# Altium project RK3588底板.PrjPcb (part 1 of 2)
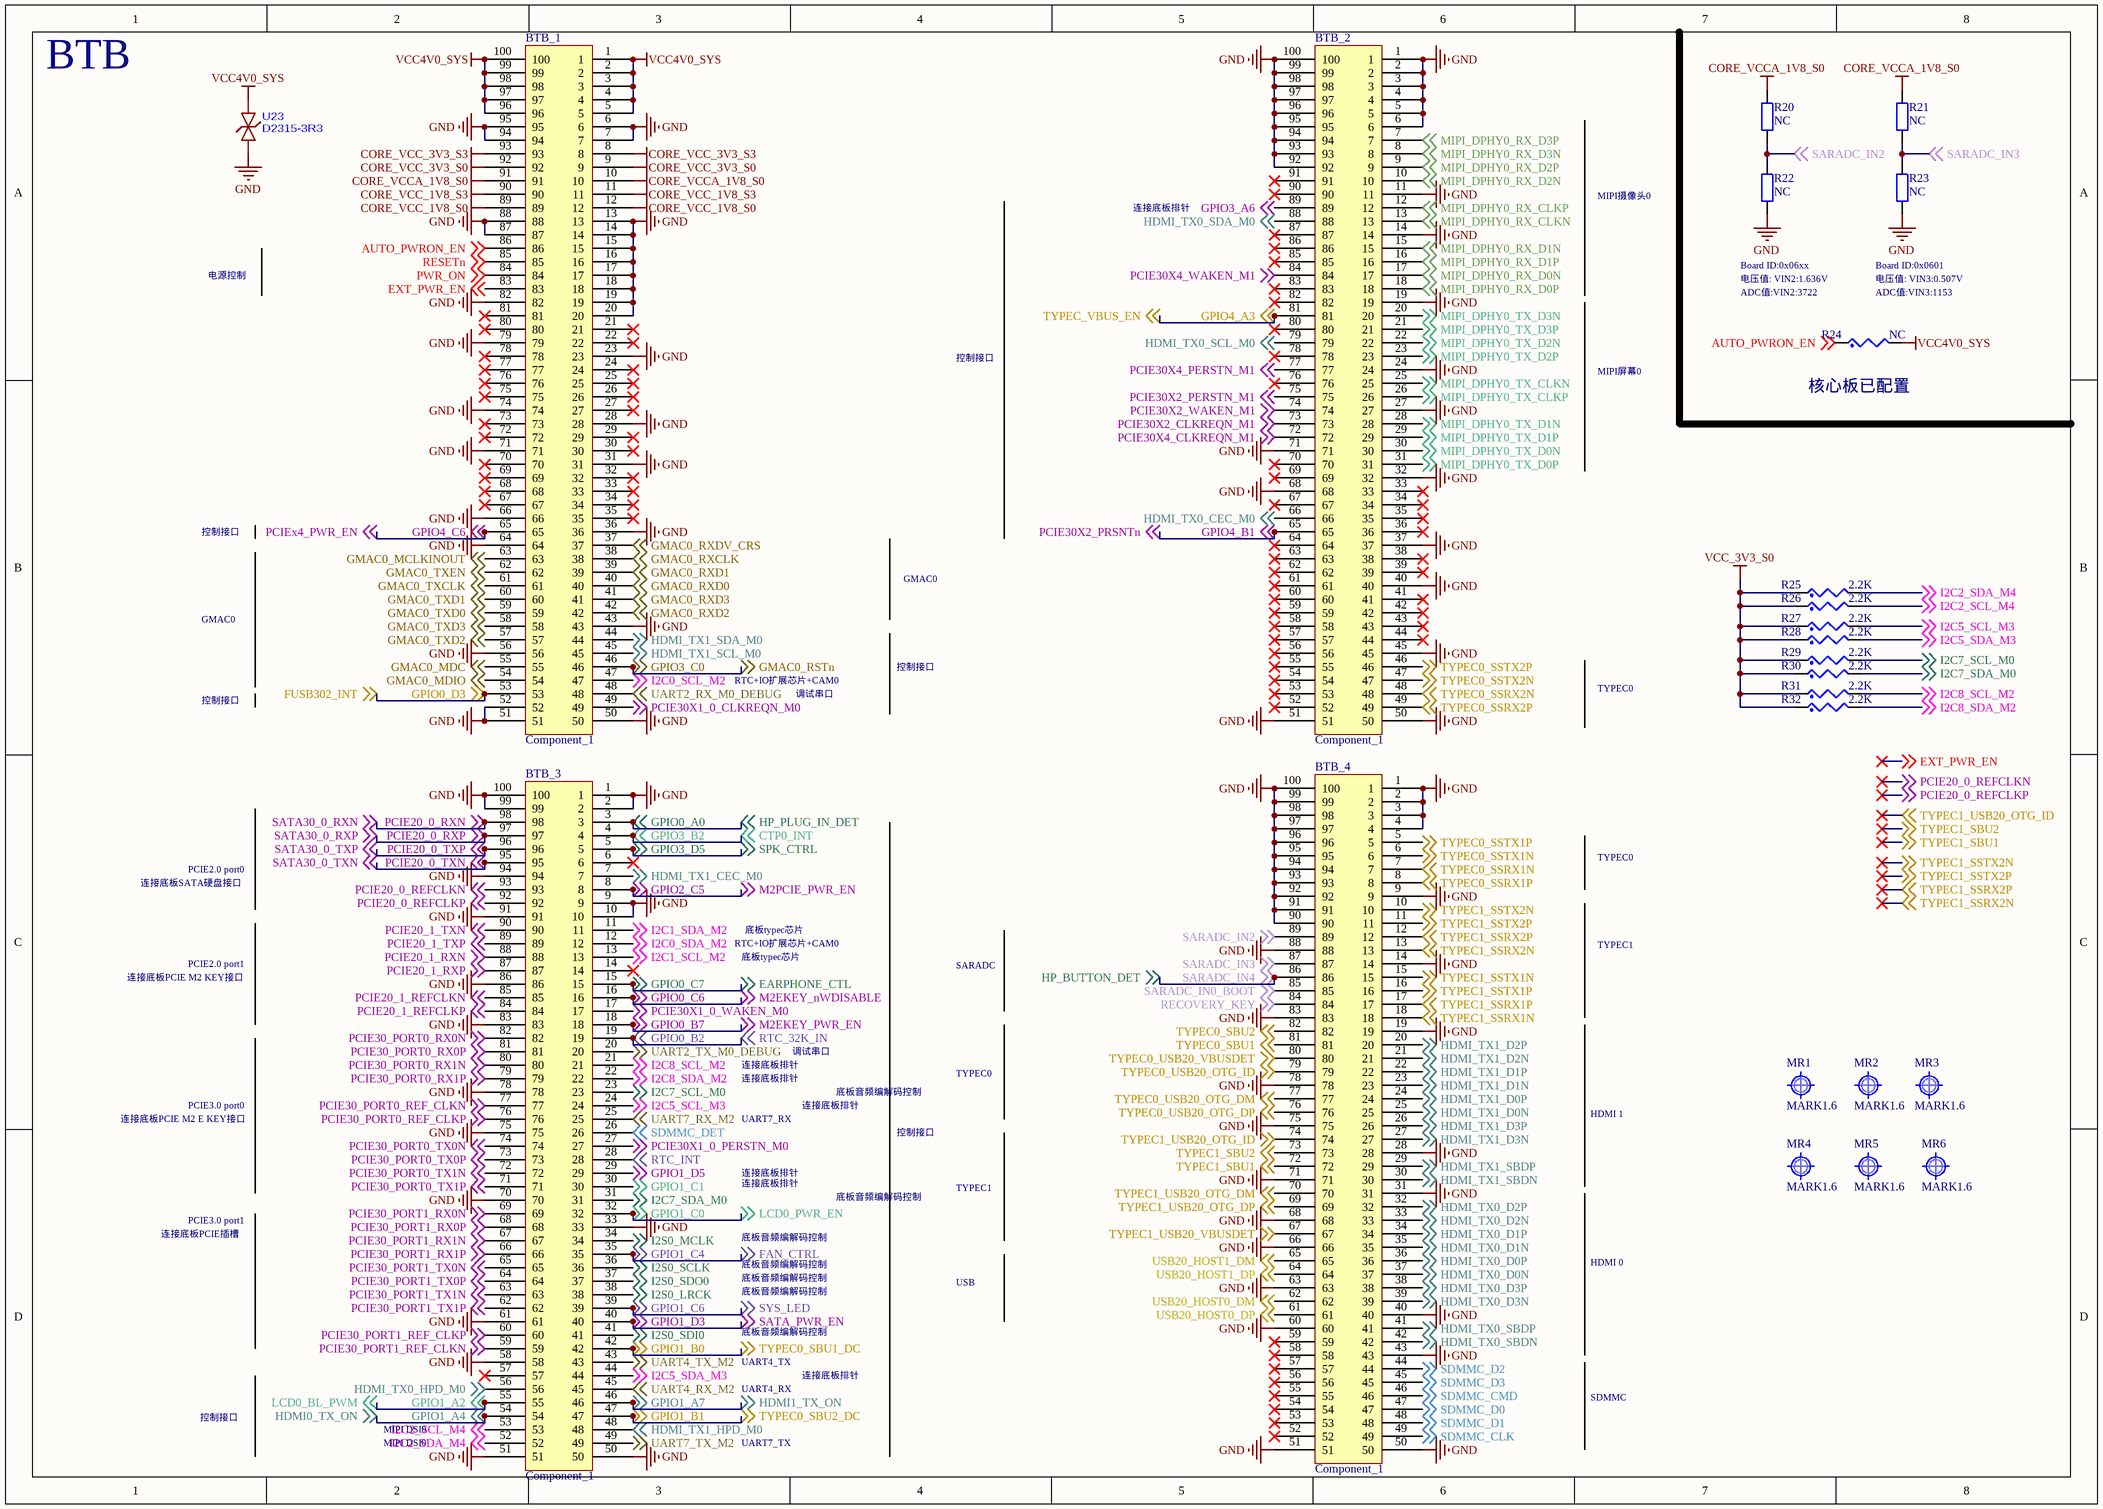
[diagram p0: 1.BTB.SchDoc]
13 sheets, 715 parts. Net scope: global (net labels, ports and power ports of the same name join across sheets).
Board file: 0.PCB1.PcbDoc
Sheets:
  1.BTB.SchDoc
  2.电源.SchDoc
  3.DEBUG_SD卡_RTC_按键.SchDoc
  4.以太网_eth1.SchDoc
  5.USB3.SchDoc
  6.音频_FAN_ADC_LED.SchDoc
  7.HDMI2.SchDoc
  8.HDMI2.SchDoc
  9.PCIE3.SchDoc
  10.PCIE2.SchDoc
  11.MIPI DSI_CSI.SchDoc
  12.SATA接口.SchDoc
  13.GPIO扩展接口.SchDoc

## Sheet 1.BTB.SchDoc
size A3; SheetNumber: 1; SheetTotal: 13

### Parts
BTB_1  Component_1  [F_100PIN]
BTB_2  Component_1  [F_100PIN]
BTB_3  Component_1  [F_100PIN]
BTB_4  Component_1  [F_100PIN]
MR1  MARK1.6  [Mark 1]
MR2  MARK1.6  [Mark 1]
MR3  MARK1.6  [Mark 1]
MR4  MARK1.6  [Mark 1]
MR5  MARK1.6  [Mark 1]
MR6  MARK1.6  [Mark 1]
R20  NC  [R0402_L]
R21  NC  [R0402_L]
R22  NC  [R0402_L]
R23  NC  [R0402_L]
R24  NC  [R0402]
R25  2.2K  [R0402]
R26  2.2K  [R0402]
R27  2.2K  [R0402]
R28  2.2K  [R0402]
R29  2.2K  [R0402]
R30  2.2K  [R0402]
R31  2.2K  [R0402]
R32  2.2K  [R0402]
U23  D2315-3R3  [DFN1006-2L-BI]

### Nets
CORE_VCC_1V8_S0: BTB_1.12 BTB_1.89
CORE_VCC_1V8_S3: BTB_1.11 BTB_1.90
CORE_VCC_3V3_S0: BTB_1.9 BTB_1.92
CORE_VCC_3V3_S3: BTB_1.8 BTB_1.93
CORE_VCCA_1V8_S0: BTB_1.10 BTB_1.91 R20.2 R21.2
GND: BTB_1.6 BTB_1.7 BTB_1.13 BTB_1.14 BTB_1.15 BTB_1.16 BTB_1.17 BTB_1.18 BTB_1.19 BTB_1.20 BTB_1.23 BTB_1.28 BTB_1.31 BTB_1.36 BTB_1.43 BTB_1.50 BTB_1.51 BTB_1.52 BTB_1.56 BTB_1.64 BTB_1.66 BTB_1.71 BTB_1.74 BTB_1.79 BTB_1.82 BTB_1.87 BTB_1.88 BTB_1.94 BTB_1.95 BTB_2.1 BTB_2.2 BTB_2.3 BTB_2.4 BTB_2.5 BTB_2.6 BTB_2.11 BTB_2.14 BTB_2.19 BTB_2.24 BTB_2.27 BTB_2.32 BTB_2.37 BTB_2.40 BTB_2.45 BTB_2.50 BTB_2.51 BTB_2.68 BTB_2.71 BTB_2.92 BTB_2.93 BTB_2.94 BTB_2.95 BTB_2.96 BTB_2.97 BTB_2.98 BTB_2.99 BTB_2.100 BTB_3.1 BTB_3.2 BTB_3.9 BTB_3.10 BTB_3.33 BTB_3.50 BTB_3.51 BTB_3.58 BTB_3.61 BTB_3.70 BTB_3.75 BTB_3.78 BTB_3.83 BTB_3.86 BTB_3.91 BTB_3.94 BTB_3.99 BTB_3.100 BTB_4.1 BTB_4.2 BTB_4.3 BTB_4.4 BTB_4.9 BTB_4.14 BTB_4.19 BTB_4.28 BTB_4.31 BTB_4.40 BTB_4.43 BTB_4.50 BTB_4.51 BTB_4.60 BTB_4.63 BTB_4.66 BTB_4.68 BTB_4.71 BTB_4.75 BTB_4.78 BTB_4.83 BTB_4.88 BTB_4.90 BTB_4.91 BTB_4.92 BTB_4.93 BTB_4.94 BTB_4.95 BTB_4.96 BTB_4.97 BTB_4.98 BTB_4.99 BTB_4.100 R22.1 R23.1 U23.1
VCC4V0_SYS: BTB_1.1 BTB_1.2 BTB_1.3 BTB_1.4 BTB_1.5 BTB_1.96 BTB_1.97 BTB_1.98 BTB_1.99 BTB_1.100 R24.2 U23.2
VCC_3V3_S0: R25.1 R26.1 R27.1 R28.1 R29.1 R30.1 R31.1 R32.1
AUTO_PWRON_EN: BTB_1.86 R24.1 ; off-sheet AUTO_PWRON_EN
CTP0_INT: BTB_3.4 ; off-sheet GPIO3_B2, off-sheet CTP0_INT  [also labelled GPIO3_B2]
EARPHONE_CTL: BTB_3.15 ; off-sheet GPIO0_C7, off-sheet EARPHONE_CTL  [also labelled GPIO0_C7]
EXT_PWR_EN: BTB_1.83 ; off-sheet EXT_PWR_EN
FAN_CTRL: BTB_3.35 ; off-sheet GPIO1_C4, off-sheet FAN_CTRL  [also labelled GPIO1_C4]
FUSB302_INT: BTB_1.53 ; off-sheet GPIO0_D3, off-sheet FUSB302_INT  [also labelled GPIO0_D3]
GMAC0_MCLKINOUT: BTB_1.63 ; off-sheet GMAC0_MCLKINOUT
GMAC0_MDC: BTB_1.55 ; off-sheet GMAC0_MDC
GMAC0_MDIO: BTB_1.54 ; off-sheet GMAC0_MDIO
GMAC0_RSTn: BTB_1.46 ; off-sheet GPIO3_C0, off-sheet GMAC0_RSTn  [also labelled GPIO3_C0]
GMAC0_RXCLK: BTB_1.38 ; off-sheet GMAC0_RXCLK
GMAC0_RXD0: BTB_1.40 ; off-sheet GMAC0_RXD0
GMAC0_RXD1: BTB_1.39 ; off-sheet GMAC0_RXD1
GMAC0_RXD2: BTB_1.42 ; off-sheet GMAC0_RXD2
GMAC0_RXD3: BTB_1.41 ; off-sheet GMAC0_RXD3
GMAC0_RXDV_CRS: BTB_1.37 ; off-sheet GMAC0_RXDV_CRS
GMAC0_TXCLK: BTB_1.61 ; off-sheet GMAC0_TXCLK
GMAC0_TXD0: BTB_1.59 ; off-sheet GMAC0_TXD0
GMAC0_TXD1: BTB_1.60 ; off-sheet GMAC0_TXD1
GMAC0_TXD2: BTB_1.57 ; off-sheet GMAC0_TXD2
GMAC0_TXD3: BTB_1.58 ; off-sheet GMAC0_TXD3
GMAC0_TXEN: BTB_1.62 ; off-sheet GMAC0_TXEN
GPIO0_A0: BTB_3.3 ; off-sheet GPIO0_A0, off-sheet HP_PLUG_IN_DET  [also labelled HP_PLUG_IN_DET]
GPIO0_B2: BTB_3.19 ; off-sheet GPIO0_B2, off-sheet RTC_32K_IN  [also labelled RTC_32K_IN]
GPIO0_B7: BTB_3.18 ; off-sheet GPIO0_B7, off-sheet M2EKEY_PWR_EN  [also labelled M2EKEY_PWR_EN]
GPIO0_C6: BTB_3.16 ; off-sheet GPIO0_C6, off-sheet M2EKEY_nWDISABLE  [also labelled M2EKEY_nWDISABLE]
GPIO1_A2: BTB_3.55 ; off-sheet GPIO1_A2, off-sheet LCD0_BL_PWM  [also labelled LCD0_BL_PWM]
GPIO1_A4: BTB_3.54 ; off-sheet GPIO1_A4, off-sheet HDMI0_TX_ON  [also labelled HDMI0_TX_ON]
GPIO1_A7: BTB_3.46 ; off-sheet GPIO1_A7, off-sheet HDMI1_TX_ON  [also labelled HDMI1_TX_ON]
GPIO1_B0: BTB_3.42 ; off-sheet GPIO1_B0, off-sheet TYPEC0_SBU1_DC  [also labelled TYPEC0_SBU1_DC]
GPIO1_B1: BTB_3.47 ; off-sheet GPIO1_B1, off-sheet TYPEC0_SBU2_DC  [also labelled TYPEC0_SBU2_DC]
GPIO1_C0: BTB_3.32 ; off-sheet GPIO1_C0, off-sheet LCD0_PWR_EN  [also labelled LCD0_PWR_EN]
GPIO1_C1: BTB_3.30 ; off-sheet GPIO1_C1
GPIO1_C6: BTB_3.39 ; off-sheet GPIO1_C6, off-sheet SYS_LED  [also labelled SYS_LED]
GPIO1_D3: BTB_3.40 ; off-sheet GPIO1_D3, off-sheet SATA_PWR_EN  [also labelled SATA_PWR_EN]
GPIO1_D5: BTB_3.29 ; off-sheet GPIO1_D5
GPIO2_C5: BTB_3.8 ; off-sheet GPIO2_C5, off-sheet M2PCIE_PWR_EN  [also labelled M2PCIE_PWR_EN]
GPIO3_A6: BTB_2.89 ; off-sheet GPIO3_A6
GPIO3_D5: BTB_3.5 ; off-sheet GPIO3_D5, off-sheet SPK_CTRL  [also labelled SPK_CTRL]
GPIO4_A3: BTB_2.81 ; off-sheet GPIO4_A3, off-sheet TYPEC_VBUS_EN  [also labelled TYPEC_VBUS_EN]
GPIO4_B1: BTB_2.65 ; off-sheet GPIO4_B1, off-sheet PCIE30X2_PRSNTn  [also labelled PCIE30X2_PRSNTn]
GPIO4_C6: BTB_1.65 ; off-sheet GPIO4_C6, off-sheet PCIEx4_PWR_EN  [also labelled PCIEx4_PWR_EN]
HDMI_TX0_CEC_M0: BTB_2.66 ; off-sheet HDMI_TX0_CEC_M0
HDMI_TX0_D0N: BTB_4.37 ; off-sheet HDMI_TX0_D0N
HDMI_TX0_D0P: BTB_4.36 ; off-sheet HDMI_TX0_D0P
HDMI_TX0_D1N: BTB_4.35 ; off-sheet HDMI_TX0_D1N
HDMI_TX0_D1P: BTB_4.34 ; off-sheet HDMI_TX0_D1P
HDMI_TX0_D2N: BTB_4.33 ; off-sheet HDMI_TX0_D2N
HDMI_TX0_D2P: BTB_4.32 ; off-sheet HDMI_TX0_D2P
HDMI_TX0_D3N: BTB_4.39 ; off-sheet HDMI_TX0_D3N
HDMI_TX0_D3P: BTB_4.38 ; off-sheet HDMI_TX0_D3P
HDMI_TX0_HPD_M0: BTB_3.56 ; off-sheet HDMI_TX0_HPD_M0
HDMI_TX0_SBDN: BTB_4.42 ; off-sheet HDMI_TX0_SBDN
HDMI_TX0_SBDP: BTB_4.41 ; off-sheet HDMI_TX0_SBDP
HDMI_TX0_SCL_M0: BTB_2.79 ; off-sheet HDMI_TX0_SCL_M0
HDMI_TX0_SDA_M0: BTB_2.88 ; off-sheet HDMI_TX0_SDA_M0
HDMI_TX1_CEC_M0: BTB_3.7 ; off-sheet HDMI_TX1_CEC_M0
HDMI_TX1_D0N: BTB_4.25 ; off-sheet HDMI_TX1_D0N
HDMI_TX1_D0P: BTB_4.24 ; off-sheet HDMI_TX1_D0P
HDMI_TX1_D1N: BTB_4.23 ; off-sheet HDMI_TX1_D1N
HDMI_TX1_D1P: BTB_4.22 ; off-sheet HDMI_TX1_D1P
HDMI_TX1_D2N: BTB_4.21 ; off-sheet HDMI_TX1_D2N
HDMI_TX1_D2P: BTB_4.20 ; off-sheet HDMI_TX1_D2P
HDMI_TX1_D3N: BTB_4.27 ; off-sheet HDMI_TX1_D3N
HDMI_TX1_D3P: BTB_4.26 ; off-sheet HDMI_TX1_D3P
HDMI_TX1_HPD_M0: BTB_3.48 ; off-sheet HDMI_TX1_HPD_M0
HDMI_TX1_SBDN: BTB_4.30 ; off-sheet HDMI_TX1_SBDN
HDMI_TX1_SBDP: BTB_4.29 ; off-sheet HDMI_TX1_SBDP
HDMI_TX1_SCL_M0: BTB_1.45 ; off-sheet HDMI_TX1_SCL_M0
HDMI_TX1_SDA_M0: BTB_1.44 ; off-sheet HDMI_TX1_SDA_M0
HP_BUTTON_DET: BTB_4.86 ; off-sheet SARADC_IN4, off-sheet HP_BUTTON_DET  [also labelled SARADC_IN4]
I2C0_SCL_M2: BTB_1.47 ; off-sheet I2C0_SCL_M2
I2C0_SDA_M2: BTB_3.12 ; off-sheet I2C0_SDA_M2
I2C1_SCL_M2: BTB_3.13 ; off-sheet I2C1_SCL_M2
I2C1_SDA_M2: BTB_3.11 ; off-sheet I2C1_SDA_M2
I2C2_SCL_M4: BTB_3.53 R26.2 ; off-sheet I2C2_SCL_M4
I2C2_SDA_M4: BTB_3.52 R25.2 ; off-sheet I2C2_SDA_M4
I2C5_SCL_M3: BTB_3.24 R27.2 ; off-sheet I2C5_SCL_M3
I2C5_SDA_M3: BTB_3.44 R28.2 ; off-sheet I2C5_SDA_M3
I2C7_SCL_M0: BTB_3.23 R29.2 ; off-sheet I2C7_SCL_M0
I2C7_SDA_M0: BTB_3.31 R30.2 ; off-sheet I2C7_SDA_M0
I2C8_SCL_M2: BTB_3.21 R31.2 ; off-sheet I2C8_SCL_M2
I2C8_SDA_M2: BTB_3.22 R32.2 ; off-sheet I2C8_SDA_M2
I2S0_LRCK: BTB_3.38 ; off-sheet I2S0_LRCK
I2S0_MCLK: BTB_3.34 ; off-sheet I2S0_MCLK
I2S0_SCLK: BTB_3.36 ; off-sheet I2S0_SCLK
I2S0_SDI0: BTB_3.41 ; off-sheet I2S0_SDI0
I2S0_SDO0: BTB_3.37 ; off-sheet I2S0_SDO0
MIPI_DPHY0_RX_CLKN: BTB_2.13 ; off-sheet MIPI_DPHY0_RX_CLKN
MIPI_DPHY0_RX_CLKP: BTB_2.12 ; off-sheet MIPI_DPHY0_RX_CLKP
MIPI_DPHY0_RX_D0N: BTB_2.17 ; off-sheet MIPI_DPHY0_RX_D0N
MIPI_DPHY0_RX_D0P: BTB_2.18 ; off-sheet MIPI_DPHY0_RX_D0P
MIPI_DPHY0_RX_D1N: BTB_2.15 ; off-sheet MIPI_DPHY0_RX_D1N
MIPI_DPHY0_RX_D1P: BTB_2.16 ; off-sheet MIPI_DPHY0_RX_D1P
MIPI_DPHY0_RX_D2N: BTB_2.10 ; off-sheet MIPI_DPHY0_RX_D2N
MIPI_DPHY0_RX_D2P: BTB_2.9 ; off-sheet MIPI_DPHY0_RX_D2P
MIPI_DPHY0_RX_D3N: BTB_2.8 ; off-sheet MIPI_DPHY0_RX_D3N
MIPI_DPHY0_RX_D3P: BTB_2.7 ; off-sheet MIPI_DPHY0_RX_D3P
MIPI_DPHY0_TX_CLKN: BTB_2.25 ; off-sheet MIPI_DPHY0_TX_CLKN
MIPI_DPHY0_TX_CLKP: BTB_2.26 ; off-sheet MIPI_DPHY0_TX_CLKP
MIPI_DPHY0_TX_D0N: BTB_2.30 ; off-sheet MIPI_DPHY0_TX_D0N
MIPI_DPHY0_TX_D0P: BTB_2.31 ; off-sheet MIPI_DPHY0_TX_D0P
MIPI_DPHY0_TX_D1N: BTB_2.28 ; off-sheet MIPI_DPHY0_TX_D1N
MIPI_DPHY0_TX_D1P: BTB_2.29 ; off-sheet MIPI_DPHY0_TX_D1P
MIPI_DPHY0_TX_D2N: BTB_2.22 ; off-sheet MIPI_DPHY0_TX_D2N
MIPI_DPHY0_TX_D2P: BTB_2.23 ; off-sheet MIPI_DPHY0_TX_D2P
MIPI_DPHY0_TX_D3N: BTB_2.20 ; off-sheet MIPI_DPHY0_TX_D3N
MIPI_DPHY0_TX_D3P: BTB_2.21 ; off-sheet MIPI_DPHY0_TX_D3P
PCIE20_0_REFCLKN: BTB_3.93 ; off-sheet PCIE20_0_REFCLKN
PCIE20_0_REFCLKP: BTB_3.92 ; off-sheet PCIE20_0_REFCLKP
PCIE20_0_RXN: BTB_3.98 ; off-sheet PCIE20_0_RXN, off-sheet SATA30_0_RXN  [also labelled SATA30_0_RXN]
PCIE20_0_RXP: BTB_3.97 ; off-sheet PCIE20_0_RXP, off-sheet SATA30_0_RXP  [also labelled SATA30_0_RXP]
PCIE20_0_TXN: BTB_3.95 ; off-sheet PCIE20_0_TXN, off-sheet SATA30_0_TXN  [also labelled SATA30_0_TXN]
PCIE20_0_TXP: BTB_3.96 ; off-sheet PCIE20_0_TXP, off-sheet SATA30_0_TXP  [also labelled SATA30_0_TXP]
PCIE20_1_REFCLKN: BTB_3.85 ; off-sheet PCIE20_1_REFCLKN
PCIE20_1_REFCLKP: BTB_3.84 ; off-sheet PCIE20_1_REFCLKP
PCIE20_1_RXN: BTB_3.88 ; off-sheet PCIE20_1_RXN
PCIE20_1_RXP: BTB_3.87 ; off-sheet PCIE20_1_RXP
PCIE20_1_TXN: BTB_3.90 ; off-sheet PCIE20_1_TXN
PCIE20_1_TXP: BTB_3.89 ; off-sheet PCIE20_1_TXP
PCIE30_PORT0_REF_CLKN: BTB_3.77 ; off-sheet PCIE30_PORT0_REF_CLKN
PCIE30_PORT0_REF_CLKP: BTB_3.76 ; off-sheet PCIE30_PORT0_REF_CLKP
PCIE30_PORT0_RX0N: BTB_3.82 ; off-sheet PCIE30_PORT0_RX0N
PCIE30_PORT0_RX0P: BTB_3.81 ; off-sheet PCIE30_PORT0_RX0P
PCIE30_PORT0_RX1N: BTB_3.80 ; off-sheet PCIE30_PORT0_RX1N
PCIE30_PORT0_RX1P: BTB_3.79 ; off-sheet PCIE30_PORT0_RX1P
PCIE30_PORT0_TX0N: BTB_3.74 ; off-sheet PCIE30_PORT0_TX0N
PCIE30_PORT0_TX0P: BTB_3.73 ; off-sheet PCIE30_PORT0_TX0P
PCIE30_PORT0_TX1N: BTB_3.72 ; off-sheet PCIE30_PORT0_TX1N
PCIE30_PORT0_TX1P: BTB_3.71 ; off-sheet PCIE30_PORT0_TX1P
PCIE30_PORT1_REF_CLKN: BTB_3.59 ; off-sheet PCIE30_PORT1_REF_CLKN
PCIE30_PORT1_REF_CLKP: BTB_3.60 ; off-sheet PCIE30_PORT1_REF_CLKP
PCIE30_PORT1_RX0N: BTB_3.69 ; off-sheet PCIE30_PORT1_RX0N
PCIE30_PORT1_RX0P: BTB_3.68 ; off-sheet PCIE30_PORT1_RX0P
PCIE30_PORT1_RX1N: BTB_3.67 ; off-sheet PCIE30_PORT1_RX1N
PCIE30_PORT1_RX1P: BTB_3.66 ; off-sheet PCIE30_PORT1_RX1P
PCIE30_PORT1_TX0N: BTB_3.65 ; off-sheet PCIE30_PORT1_TX0N
PCIE30_PORT1_TX0P: BTB_3.64 ; off-sheet PCIE30_PORT1_TX0P
PCIE30_PORT1_TX1N: BTB_3.63 ; off-sheet PCIE30_PORT1_TX1N
PCIE30_PORT1_TX1P: BTB_3.62 ; off-sheet PCIE30_PORT1_TX1P
PCIE30X1_0_CLKREQN_M0: BTB_1.49 ; off-sheet PCIE30X1_0_CLKREQN_M0
PCIE30X1_0_PERSTN_M0: BTB_3.27 ; off-sheet PCIE30X1_0_PERSTN_M0
PCIE30X1_0_WAKEN_M0: BTB_3.17 ; off-sheet PCIE30X1_0_WAKEN_M0
PCIE30X2_CLKREQN_M1: BTB_2.73 ; off-sheet PCIE30X2_CLKREQN_M1
PCIE30X2_PERSTN_M1: BTB_2.75 ; off-sheet PCIE30X2_PERSTN_M1
PCIE30X2_WAKEN_M1: BTB_2.74 ; off-sheet PCIE30X2_WAKEN_M1
PCIE30X4_CLKREQN_M1: BTB_2.72 ; off-sheet PCIE30X4_CLKREQN_M1
PCIE30X4_PERSTN_M1: BTB_2.77 ; off-sheet PCIE30X4_PERSTN_M1
PCIE30X4_WAKEN_M1: BTB_2.84 ; off-sheet PCIE30X4_WAKEN_M1
PWR_ON: BTB_1.84 ; off-sheet PWR_ON
RECOVERY_KEY: BTB_4.84 ; off-sheet RECOVERY_KEY
RESETn: BTB_1.85 ; off-sheet RESETn
RTC_INT: BTB_3.28 ; off-sheet RTC_INT
SARADC_IN0_BOOT: BTB_4.85 ; off-sheet SARADC_IN0_BOOT
SARADC_IN2: BTB_4.89 R20.1 R22.2 ; off-sheet SARADC_IN2
SARADC_IN3: BTB_4.87 R21.1 R23.2 ; off-sheet SARADC_IN3
SDMMC_CLK: BTB_4.49 ; off-sheet SDMMC_CLK
SDMMC_CMD: BTB_4.46 ; off-sheet SDMMC_CMD
SDMMC_D0: BTB_4.47 ; off-sheet SDMMC_D0
SDMMC_D1: BTB_4.48 ; off-sheet SDMMC_D1
SDMMC_D2: BTB_4.44 ; off-sheet SDMMC_D2
SDMMC_D3: BTB_4.45 ; off-sheet SDMMC_D3
SDMMC_DET: BTB_3.26 ; off-sheet SDMMC_DET
TYPEC0_SBU1: BTB_4.81 ; off-sheet TYPEC0_SBU1
TYPEC0_SBU2: BTB_4.82 ; off-sheet TYPEC0_SBU2
TYPEC0_SSRX1N: BTB_4.7 ; off-sheet TYPEC0_SSRX1N
TYPEC0_SSRX1P: BTB_4.8 ; off-sheet TYPEC0_SSRX1P
TYPEC0_SSRX2N: BTB_2.48 ; off-sheet TYPEC0_SSRX2N
TYPEC0_SSRX2P: BTB_2.49 ; off-sheet TYPEC0_SSRX2P
TYPEC0_SSTX1N: BTB_4.6 ; off-sheet TYPEC0_SSTX1N
TYPEC0_SSTX1P: BTB_4.5 ; off-sheet TYPEC0_SSTX1P
TYPEC0_SSTX2N: BTB_2.47 ; off-sheet TYPEC0_SSTX2N
TYPEC0_SSTX2P: BTB_2.46 ; off-sheet TYPEC0_SSTX2P
TYPEC0_USB20_OTG_DM: BTB_4.77 ; off-sheet TYPEC0_USB20_OTG_DM
TYPEC0_USB20_OTG_DP: BTB_4.76 ; off-sheet TYPEC0_USB20_OTG_DP
TYPEC0_USB20_OTG_ID: BTB_4.79 ; off-sheet TYPEC0_USB20_OTG_ID
TYPEC0_USB20_VBUSDET: BTB_4.80 ; off-sheet TYPEC0_USB20_VBUSDET
TYPEC1_SBU1: BTB_4.72 ; off-sheet TYPEC1_SBU1
TYPEC1_SBU2: BTB_4.73 ; off-sheet TYPEC1_SBU2
TYPEC1_SSRX1N: BTB_4.18 ; off-sheet TYPEC1_SSRX1N
TYPEC1_SSRX1P: BTB_4.17 ; off-sheet TYPEC1_SSRX1P
TYPEC1_SSRX2N: BTB_4.13 ; off-sheet TYPEC1_SSRX2N
TYPEC1_SSRX2P: BTB_4.12 ; off-sheet TYPEC1_SSRX2P
TYPEC1_SSTX1N: BTB_4.15 ; off-sheet TYPEC1_SSTX1N
TYPEC1_SSTX1P: BTB_4.16 ; off-sheet TYPEC1_SSTX1P
TYPEC1_SSTX2N: BTB_4.10 ; off-sheet TYPEC1_SSTX2N
TYPEC1_SSTX2P: BTB_4.11 ; off-sheet TYPEC1_SSTX2P
TYPEC1_USB20_OTG_DM: BTB_4.70 ; off-sheet TYPEC1_USB20_OTG_DM
TYPEC1_USB20_OTG_DP: BTB_4.69 ; off-sheet TYPEC1_USB20_OTG_DP
TYPEC1_USB20_OTG_ID: BTB_4.74 ; off-sheet TYPEC1_USB20_OTG_ID
TYPEC1_USB20_VBUSDET: BTB_4.67 ; off-sheet TYPEC1_USB20_VBUSDET
UART2_RX_M0_DEBUG: BTB_1.48 ; off-sheet UART2_RX_M0_DEBUG
UART2_TX_M0_DEBUG: BTB_3.20 ; off-sheet UART2_TX_M0_DEBUG
UART4_RX_M2: BTB_3.45 ; off-sheet UART4_RX_M2
UART4_TX_M2: BTB_3.43 ; off-sheet UART4_TX_M2
UART7_RX_M2: BTB_3.25 ; off-sheet UART7_RX_M2
UART7_TX_M2: BTB_3.49 ; off-sheet UART7_TX_M2
USB20_HOST0_DM: BTB_4.62 ; off-sheet USB20_HOST0_DM
USB20_HOST0_DP: BTB_4.61 ; off-sheet USB20_HOST0_DP
USB20_HOST1_DM: BTB_4.65 ; off-sheet USB20_HOST1_DM
USB20_HOST1_DP: BTB_4.64 ; off-sheet USB20_HOST1_DP

Not connected (* = marked no-connect by the designer): BTB_1 21* 22* 24* 25* 26* 27* 29* 30* 32* 33* 34* 35* 67* 68* 69* 70* 72* 73* 75* 76* 77* 78* 80* 81*; BTB_2 33* 34* 35* 36* 38* 39* 41* 42* 43* 44* 52* 53* 54* 55* 56* 57* 58* 59* 60* 61* 62* 63* 64* 67* 69* 70* 76* 78* 80* 82* 83* 85* 86* 87* 90* 91*; BTB_3 6* 14* 57*; BTB_4 52* 53* 54* 55* 56* 57* 58* 59*

### Notes on the sheet
- BTB
- 连接底板排针
- MIPI摄像头0
- 电源控制
- Board ID:0x06xx
- 电压值: VIN2:1.636V
- ADC值:VIN2:3722
- Board ID:0x0601
- 电压值: VIN3:0.507V
- (near R24) ADC值:VIN3:1153
- 控制接口
- MIPI屏幕0
- (near R24) 核心板已配置
- GMAC0
- RTC+IO扩展芯片+CAM0
- 调试串口
- TYPEC0
- 连接底板SATA硬盘接口
- PCIE2.0 port0
- 连接底板PCIE M2 KEY接口
- PCIE2.0 port1
- 底板typec芯片
- SARADC
- TYPEC1
- 连接底板PCIE M2 E KEY接口
- PCIE3.0 port0
- UART7_RX
- 底板音频编解码控制
- HDMI 1
- 连接底板PCIE插槽
- PCIE3.0 port1
- USB
- HDMI 0
- UART4_RX
- UART4_TX
- MIPI DSI0
- UART7_TX
- SDMMC

### Library data of the parts
BTB_1-BTB_4 = Component_1_1
MR1-MR6 = MARK: 光学定位点
R20-R23 = R: 贴片电阻
R24-R32 = RES

## Sheet 2.电源.SchDoc
size 297 x 209 mm; SheetNumber: 2; SheetTotal: 13
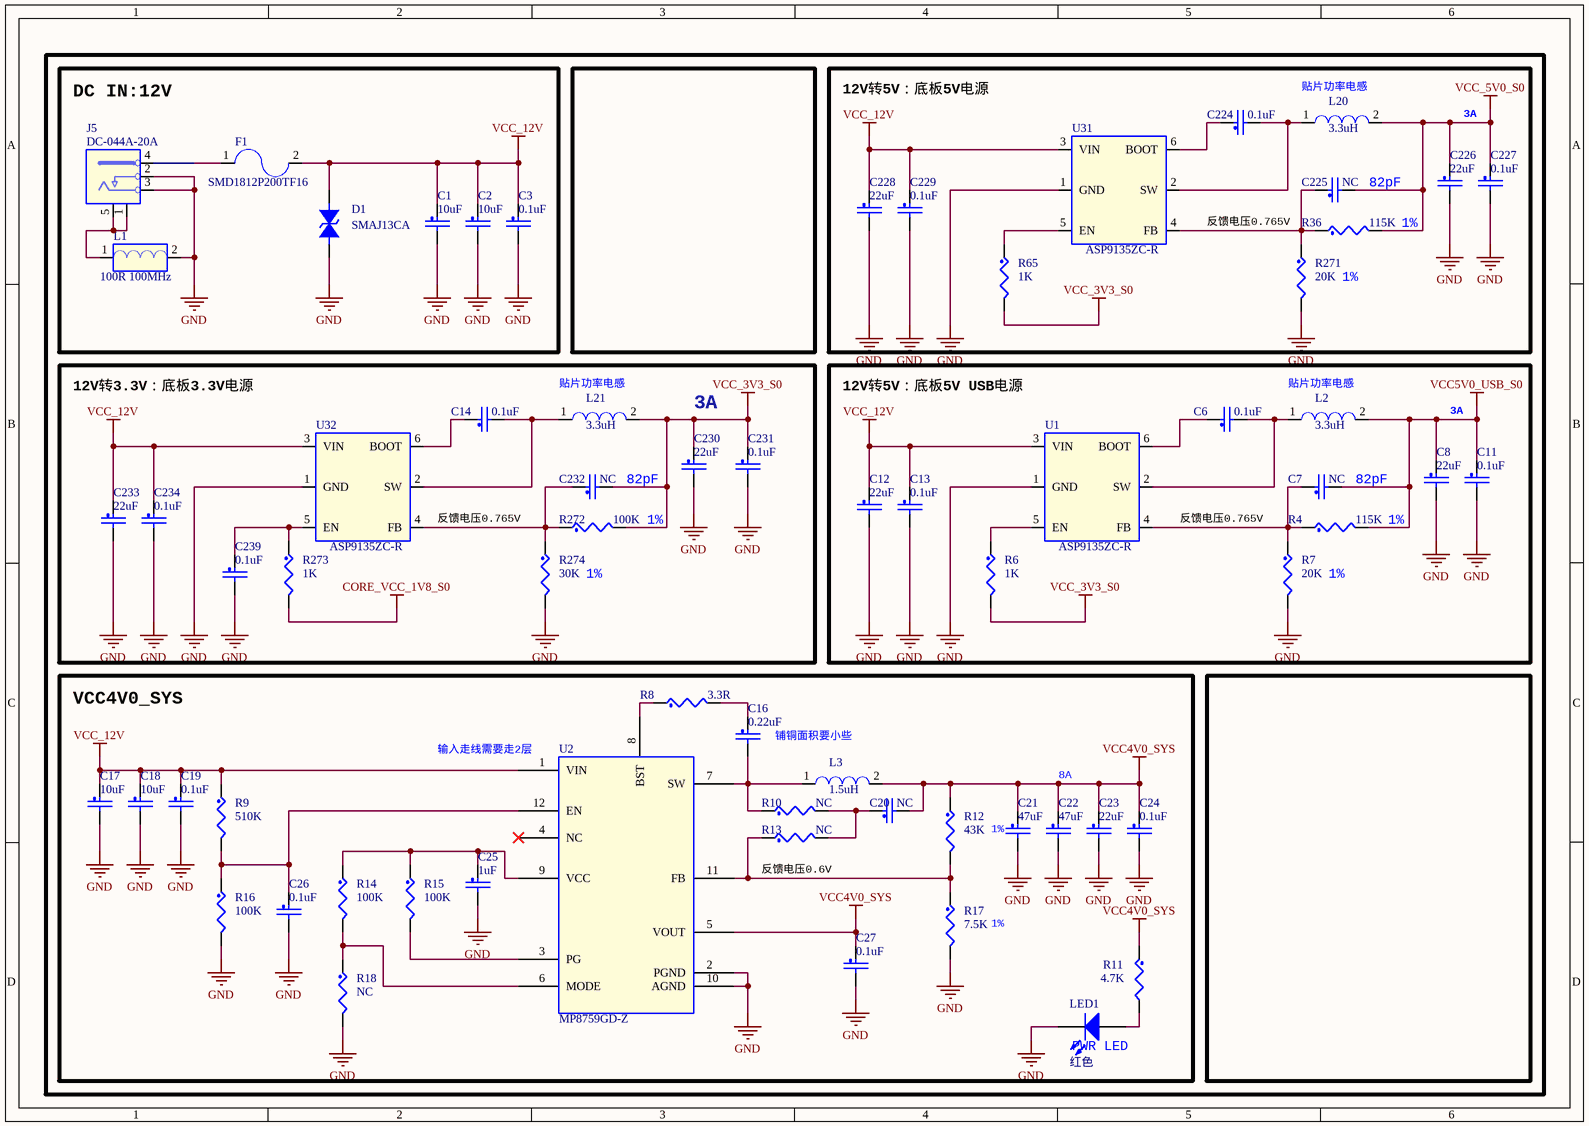
[diagram p1: 2.电源.SchDoc]

### Parts
C1  10uF  [C0603]
C2  10uF  [C0603]
C3  0.1uF  [C0402]
C6  0.1uF  [C0402]
C7  NC  [C0402]
C8  22uF  [C0805]
C11  0.1uF  [C0402]
C12  22uF  [C0805]
C13  0.1uF  [C0402]
C14  0.1uF  [C0402]
C16  0.22uF  [C0402]
C17  10uF  [C0603]
C18  10uF  [C0603]
C19  0.1uF  [C0402]
C20  NC  [C0402]
C21  47uF  [C0805]
C22  47uF  [C0805]
C23  22uF  [C0603]
C24  0.1uF  [C0402]
C25  1uF  [C0402]
C26  0.1uF  [C0402]
C27  0.1uF  [C0402]
C224  0.1uF  [C0402]
C225  NC  [C0402]
C226  22uF  [C0805]
C227  0.1uF  [C0402]
C228  22uF  [C0805]
C229  0.1uF  [C0402]
C230  22uF  [C0805]
C231  0.1uF  [C0402]
C232  NC  [C0402]
C233  22uF  [C0805]
C234  0.1uF  [C0402]
C239  0.1uF  [C0402]
D1  SMAJ13CA  [SMA_CA]
F1  SMD1812P200TF16  [F1812]
J5  DC-044A-20A  [dc_in_th_3p_10r1x11r6]
L1  100R 100MHz  [L0603]
L2  3.3uH  [l4520]
L3  1.5uH  [L0518]
L20  3.3uH  [l4520]
L21  3.3uH  [l4520]
LED1  红色  [LED0603_R]
R4  115K  [R0402]
R6  1K  [R0402]
R7  20K  [R0402]
R8  3.3R  [R0402]
R9  510K  [R0402]
R10  NC  [R0402]
R11  4.7K  [R0402]
R12  43K  [R0402]
R13  NC  [R0402]
R14  100K  [R0402]
R15  100K  [R0402]
R16  100K  [R0402]
R17  7.5K  [R0402]
R18  NC  [R0402]
R36  115K  [R0402]
R65  1K  [R0402]
R271  20K  [R0402]
R272  100K  [R0402]
R273  1K  [R0402]
R274  30K  [R0402]
U1  ASP9135ZC-R  [SOT23_6]
U2  MP8759GD-Z  [QFN12-2R00X3R00]
U31  ASP9135ZC-R  [SOT23_6]
U32  ASP9135ZC-R  [SOT23_6]

### Blocks framed on the sheet
DC IN:12V: C1-C3 D1 F1 J5 L1
12V转5V：底板5V电源: C224-C229 L20 R36 R65 R271 U31
3A: C14 C230-C234 C239 L21 R272-R274 U32
12V转5V：底板5V USB电源: C6-C8 C11-C13 L2 R4 R6 R7 U1
VCC4V0_SYS: C16-C27 L3 LED1 R8-R18 U2

### Nets
CORE_VCC_1V8_S0: R273.2
GND: C1.2 C2.2 C3.2 C8.2 C11.2 C12.2 C13.2 C17.2 C18.2 C19.2 C21.2 C22.2 C23.2 C24.2 C25.2 C26.2 C27.2 C226.2 C227.2 C228.2 C229.2 C230.2 C231.2 C233.2 C234.2 C239.2 D1.1 J5.2 J5.3 L1.2 LED1.2(K) R7.2 R16.2 R17.2 R18.2 R271.2 R274.2 U1.1(GND) U2.2(PGND) U2.10(AGND) U31.1(GND) U32.1(GND)
VCC4V0_SYS: C20.2 C21.1 C22.1 C23.1 C24.1 C27.1 L3.2 R11.1 R12.1 U2.5(VOUT)
VCC5V0_USB_S0: C7.2 C8.1 C11.1 L2.2 R4.2
VCC_3V3_S0: C230.1 C231.1 C232.2 L21.2 R6.2 R65.2 R272.2
VCC_5V0_S0: C225.2 C226.1 C227.1 L20.2 R36.2
VCC_12V: C1.1 C2.1 C3.1 C12.1 C13.1 C17.1 C18.1 C19.1 C228.1 C229.1 C233.1 C234.1 D1.2 F1.2 R9.1 U1.3(VIN) U2.1(VIN) U31.3(VIN) U32.3(VIN)
NetC6_1: C6.1 U1.6(BOOT)
NetC6_2: C6.2 L2.1 U1.2(SW)
NetC7_1: C7.1 R4.1 R7.1 U1.4(FB)
NetC14_1: C14.1 U32.6(BOOT)
NetC14_2: C14.2 L21.1 U32.2(SW)
NetC16_1: C16.1 R8.2
NetC16_2: C16.2 L3.1 R10.1 U2.7(SW)
NetC20_1: C20.1 R10.2 R13.2
NetC25_1: C25.1 R14.1 R15.1 U2.9(VCC)
NetC26_1: C26.1 R9.2 R16.1 U2.12(EN)
NetC224_1: C224.1 U31.6(BOOT)
NetC224_2: C224.2 L20.1 U31.2(SW)
NetC225_1: C225.1 R36.1 R271.1 U31.4(FB)
NetC232_1: C232.1 R272.1 R274.1 U32.4(FB)
NetC239_1: C239.1 R273.1 U32.5(EN)
NetF1_1: F1.1 J5.4
NetJ5_1: J5.1 J5.5 L1.1
NetLED1_1: LED1.1(A) R11.2
NetR6_1: R6.1 U1.5(EN)
NetR8_1: R8.1 U2.8(BST)
NetR12_2: R12.2 R13.1 R17.1 U2.11(FB)
NetR14_2: R14.2 R18.1 U2.6(MODE)
NetR15_2: R15.2 U2.3(PG)
NetR65_1: R65.1 U31.5(EN)

Not connected (* = marked no-connect by the designer): U2 4(NC)*

### Notes on the sheet
- (near L20) 贴片功率电感
- 3A
- 82pF
- 反馈电压0.765V
- 1%
- 12V转3.3V：底板3.3V电源
- (near L21) 贴片功率电感
- (near L2) 贴片功率电感
- (near U32) 反馈电压0.765V
- 铺铜面积要小些
- 输入走线需要走2层
- 8A
- (near R13) 反馈电压0.6V
- (near C21) 1%
- (near R17) 1%
- (near LED1) PWR LED

### Library data of the parts
C1-C3 C6-C8 C11-C14 C16-C27 C224-C234 C239 = CAP_NP
D1 = DIODE BI-DIR TRIG
F1 = FUSE
L1 = BEAD
L2 L3 L20 L21 = IND
LED1 = LED: 贴片LED
R4 R6-R18 R36 R65 R271-R274 = RES
U1 U31 U32 = TP6327GS6

## Sheet 3.DEBUG_SD卡_RTC_按键.SchDoc
size 297 x 209 mm; SheetNumber: 3; SheetTotal: 13
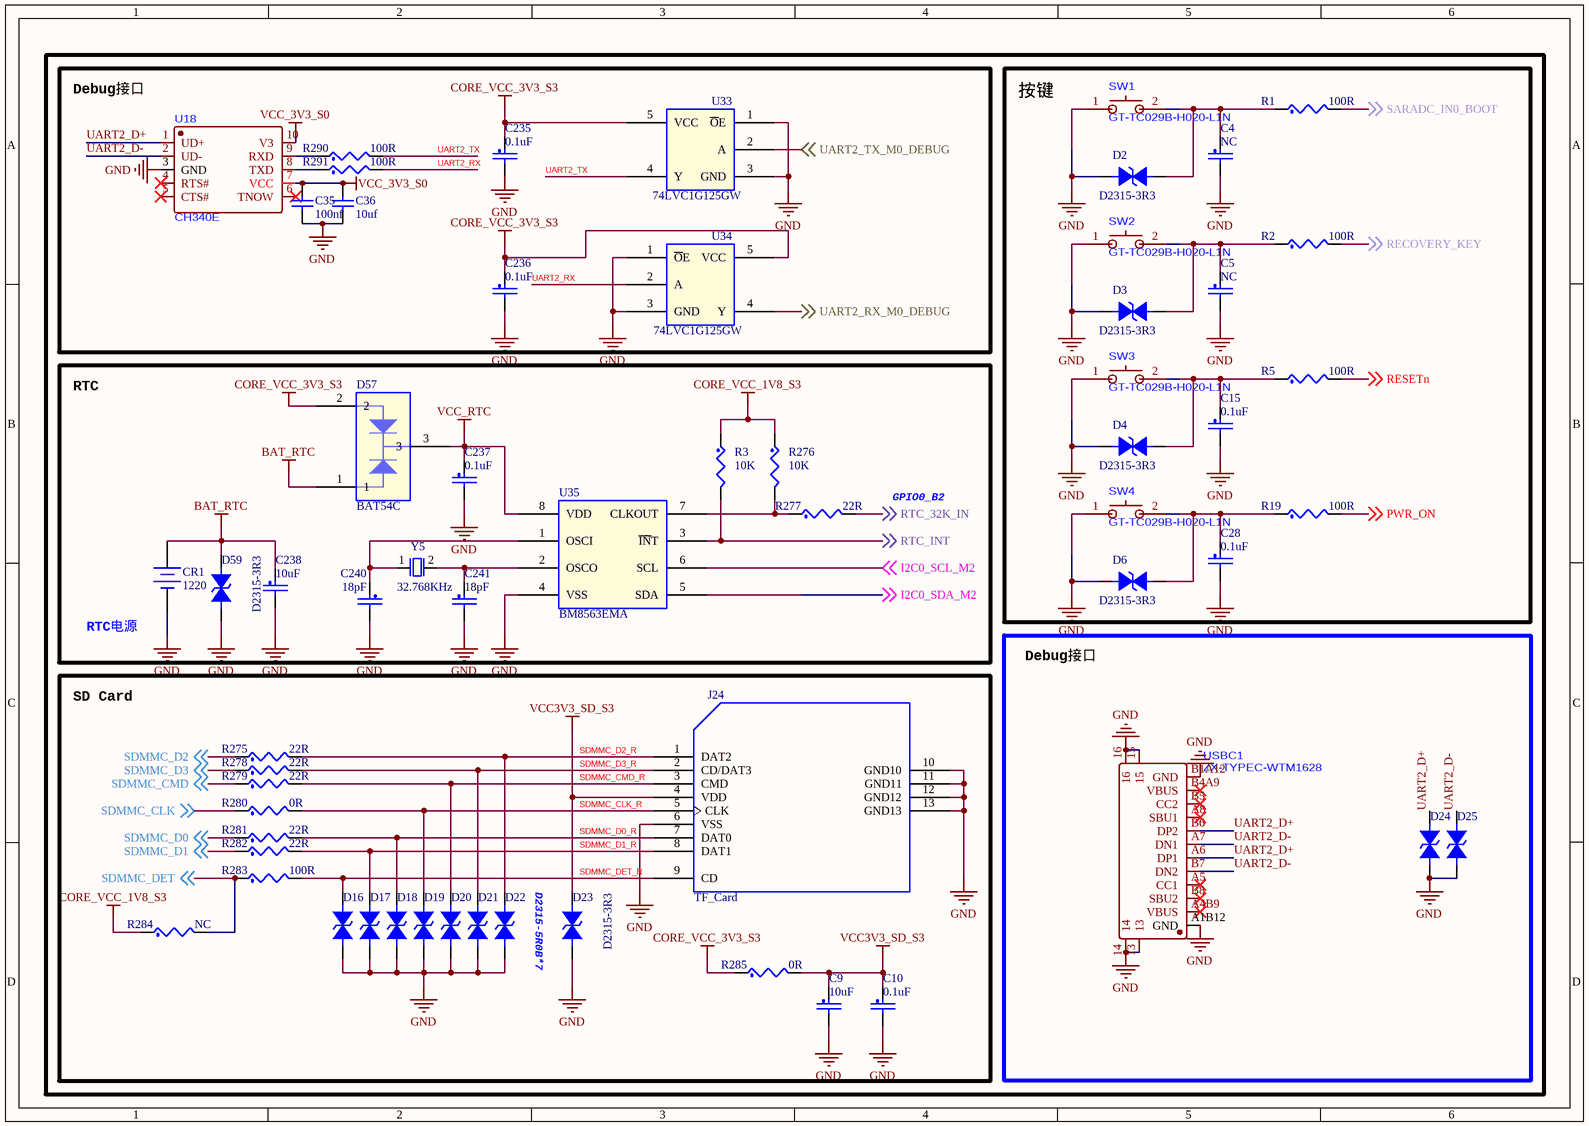
[diagram p2: 3.DEBUG_SD卡_RTC_按键.SchDoc]

### Parts
C4  NC  [C0402]
C5  NC  [C0402]
C9  10uF  [C0402]
C10  0.1uF  [C0402]
C15  0.1uF  [C0402]
C28  0.1uF  [C0402]
C35  100nf  [C0603_L]
C36  10uf  [C0603_L]
C235  0.1uF  [C0402]
C236  0.1uF  [C0402]
C237  0.1uF  [C0402]
C238  10uF  [C0402]
C240  18pF  [C0402]
C241  18pF  [C0402]
CR1  1220  [CR1220_A]
D2  D2315-3R3  [esd0402]
D3  D2315-3R3  [esd0402]
D4  D2315-3R3  [esd0402]
D6  D2315-3R3  [esd0402]
D16  D2315-5R0B  [esd0402]  (value not drawn)
D17  D2315-5R0B  [esd0402]  (value not drawn)
D18  D2315-5R0B  [esd0402]  (value not drawn)
D19  D2315-5R0B  [esd0402]  (value not drawn)
D20  D2315-5R0B  [esd0402]  (value not drawn)
D21  D2315-5R0B  [esd0402]  (value not drawn)
D22  D2315-5R0B  [esd0402]  (value not drawn)
D23  D2315-3R3  [esd0402]
D24  D2315-5R0B  [esd0402]  (value not drawn)
D25  D2315-5R0B  [esd0402]  (value not drawn)
D57  BAT54C  [SOT23]
D59  D2315-3R3  [esd0402]
J24  TF_Card  [TFCARD]
R1  100R  [R0402]
R2  100R  [R0402]
R3  10K  [R0402]
R5  100R  [R0402]
R19  100R  [R0402]
R275  22R  [R0402]
R276  10K  [R0402]
R277  22R  [R0402]
R278  22R  [R0402]
R279  22R  [R0402]
R280  0R  [R0402]
R281  22R  [R0402]
R282  22R  [R0402]
R283  100R  [R0402]
R284  NC  [R0402]
R285  0R  [R0402]
R290  100R  [R0402]
R291  100R  [R0402]
SW1  GT-TC029B-H020-L1N  [SW-SMD_L3.9-W2.9-P4.15-LS5.0]
SW2  GT-TC029B-H020-L1N  [SW-SMD_L3.9-W2.9-P4.15-LS5.0]
SW3  GT-TC029B-H020-L1N  [SW-SMD_L3.9-W2.9-P4.15-LS5.0]
SW4  GT-TC029B-H020-L1N  [SW-SMD_L3.9-W2.9-P4.15-LS5.0]
U18  CH340E  [MSOP-10_L3.0-W3.0-P0.50-LS5.0-BL]
U33  74LVC1G125GW  [SOT-353]
U34  74LVC1G125GW  [SOT-353]
U35  BM8563EMA  [msop-8]
USBC1  ZX-TYPEC-WTM1628  [USB-C-SMD_ZX-TYPEC-WTM1628]
Y5  32.768KHz  [3215]

### Blocks framed on the sheet
Debug接口: C35 C36 C235 C236 R290 R291 U18 U33 U34
按键: C4 C5 C15 C28 D2-D4 D6 R1 R2 R5 R19 SW1-SW4
RTC: C237 C238 C240 C241 CR1 D57 D59 R3 R276 R277 U35 Y5
Debug接口: D24 D25 USBC1
SD Card: C9 C10 D16-D23 J24 R275 R278-R285

### Nets
BAT_RTC: C238.1 CR1.1(DC+) D57.1 D59.1
CORE_VCC_1V8_S3: R3.1 R276.1 R284.1
CORE_VCC_3V3_S3: C235.1 C236.1 D57.2 R285.1 U33.5(VCC) U34.5(VCC)
GND: C4.2 C5.2 C9.2 C10.2 C15.2 C28.2 C35.1 C36.1 C235.2 C236.2 C237.2 C238.2 C240.2 C241.2 CR1.2(DC-) D2.1 D3.1 D4.1 D6.1 D16.1 D17.1 D18.1 D19.1 D20.1 D21.1 D22.1 D23.2 D24.1 D25.1 D59.2 J24.6(VSS) J24.10(GND10) J24.11(GND11) J24.12(GND12) J24.13(GND13) SW1.1 SW2.1 SW3.1 SW4.1 U18.3(GND) U33.1(~{O}E) U33.3(GND) U34.1(~{O}E) U34.3(GND) U35.4(VSS) USBC1.13 USBC1.14 USBC1.15 USBC1.16 USBC1.A1B12(GND) USBC1.B1A12(GND)
VCC3V3_SD_S3: C9.1 C10.1 D23.1 J24.4(VDD) R285.2
VCC_3V3_S0: C35.2 C36.2 U18.7(VCC) U18.10(V3)
VCC_RTC: C237.1 D57.3 U35.8(VDD)
I2C0_SCL_M2: U35.6(SCL) ; off-sheet I2C0_SCL_M2
I2C0_SDA_M2: U35.5(SDA) ; off-sheet I2C0_SDA_M2
PWR_ON: R19.2 ; off-sheet PWR_ON
RECOVERY_KEY: R2.2 ; off-sheet RECOVERY_KEY
RESETn: R5.2 ; off-sheet RESETn
RTC_32K_IN: R277.2 ; off-sheet RTC_32K_IN  [project net GPIO0_B2]
RTC_INT: R3.2 U35.3(~{IN}T) ; off-sheet RTC_INT
SARADC_IN0_BOOT: R1.2 ; off-sheet SARADC_IN0_BOOT
SDMMC_CLK: R280.1 ; off-sheet SDMMC_CLK
SDMMC_CLK_R: D19.2 J24.5(CLK) R280.2
SDMMC_CMD: R279.1 ; off-sheet SDMMC_CMD
SDMMC_CMD_R: D20.2 J24.3(CMD) R279.2
SDMMC_D0: R281.1 ; off-sheet SDMMC_D0
SDMMC_D0_R: D18.2 J24.7(DAT0) R281.2
SDMMC_D1: R282.1 ; off-sheet SDMMC_D1
SDMMC_D1_R: D17.2 J24.8(DAT1) R282.2
SDMMC_D2: R275.1 ; off-sheet SDMMC_D2
SDMMC_D2_R: D22.2 J24.1(DAT2) R275.2
SDMMC_D3: R278.1 ; off-sheet SDMMC_D3
SDMMC_D3_R: D21.2 J24.2(CD/DAT3) R278.2
SDMMC_DET: R283.1 R284.2 ; off-sheet SDMMC_DET
SDMMC_DET_R: D16.2 J24.9(CD) R283.2
UART2_D+: D24.2 U18.1(UD+) USBC1.A6(DP1) USBC1.B6(DP2)
UART2_D-: D25.2 U18.2(UD-) USBC1.A7(DN1) USBC1.B7(DN2)
UART2_RX: R291.2 U34.2(A)
UART2_RX_M0_DEBUG: U34.4(Y) ; off-sheet UART2_RX_M0_DEBUG
UART2_TX: R290.2 U33.4(Y)
UART2_TX_M0_DEBUG: U33.2(A) ; off-sheet UART2_TX_M0_DEBUG
NetC4_1: C4.1 D2.2 R1.1 SW1.2
NetC5_1: C5.1 D3.2 R2.1 SW2.2
NetC15_1: C15.1 D4.2 R5.1 SW3.2
NetC28_1: C28.1 D6.2 R19.1 SW4.2
NetC240_1: C240.1 U35.1(OSCI) Y5.1
NetC241_1: C241.1 U35.2(OSCO) Y5.2
NetR276_2: R276.2 R277.1 U35.7(CLKOUT)
NetR290_1: R290.1 U18.9(RXD)
NetR291_1: R291.1 U18.8(TXD)

Not connected (* = marked no-connect by the designer): U18 4(RTS#)* 5(CTS#)* 6(TNOW)*; USBC1 A4B9(VBUS)* A5(CC1)* A8(SBU1)* B4A9(VBUS)* B5(CC2)* B8(SBU2)*

### Notes on the sheet
- (near R277) GPIO0_B2
- RTC电源
- D2315-5R0B*7

### Library data of the parts
C4 C5 C9 C10 C15 C28 C235-C238 C240 C241 = CAP_NP
C35 C36 = C: 贴片电容/MLCC电容
CR1 = BAT_CR1220_CR2032: 微型电池
D2-D4 D6 D16-D25 D59 = DIODE BI-DIR TRIG
R1-R3 R5 R19 R275-R285 R290 R291 = RES
U33 U34 = 74LVC1G125
U35 = HYM8563S
Y5 = CRYSTAL_2P

## Sheet 4.以太网_eth1.SchDoc
size 297 x 209 mm; SheetNumber: 4; SheetTotal: 13
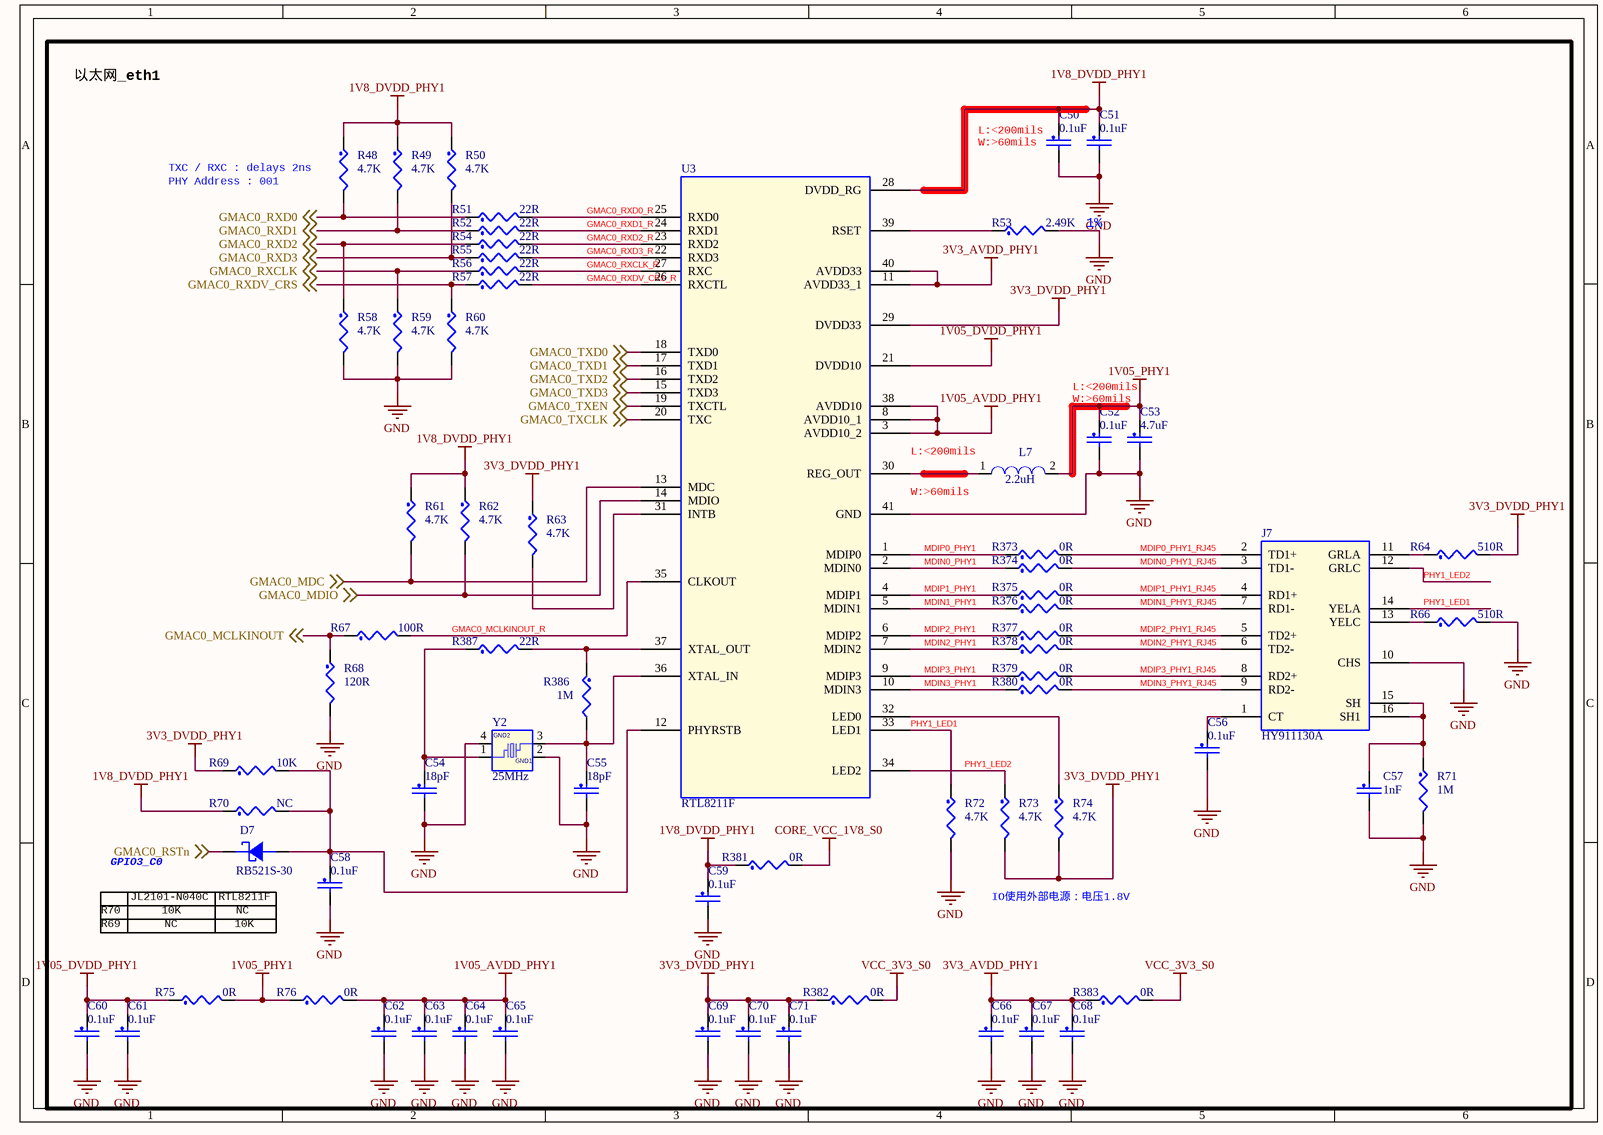
[diagram p3: 4.以太网_eth1.SchDoc]

### Parts
C50  0.1uF  [C0402]
C51  0.1uF  [C0402]
C52  0.1uF  [C0402]
C53  4.7uF  [C0402]
C54  18pF  [C0402]
C55  18pF  [C0402]
C56  0.1uF  [C0402]
C57  1nF  [C0805]
C58  0.1uF  [C0402]
C59  0.1uF  [C0402]
C60  0.1uF  [C0402]
C61  0.1uF  [C0402]
C62  0.1uF  [C0402]
C63  0.1uF  [C0402]
C64  0.1uF  [C0402]
C65  0.1uF  [C0402]
C66  0.1uF  [C0402]
C67  0.1uF  [C0402]
C68  0.1uF  [C0402]
C69  0.1uF  [C0402]
C70  0.1uF  [C0402]
C71  0.1uF  [C0402]
D7  RB521S-30  [SOD523]
J7  HY911130A  [HY911130A]
L7  2.2uH  [L2520]
R48  4.7K  [R0402]
R49  4.7K  [R0402]
R50  4.7K  [R0402]
R51  22R  [R0402]
R52  22R  [R0402]
R53  2.49K  [R0402]
R54  22R  [R0402]
R55  22R  [R0402]
R56  22R  [R0402]
R57  22R  [R0402]
R58  4.7K  [R0402]
R59  4.7K  [R0402]
R60  4.7K  [R0402]
R61  4.7K  [R0402]
R62  4.7K  [R0402]
R63  4.7K  [R0402]
R64  510R  [R0603]
R66  510R  [R0603]
R67  100R  [R0402]
R68  120R  [R0402]
R69  10K  [R0402]
R70  NC  [R0402]
R71  1M  [R0805]
R72  4.7K  [R0402]
R73  4.7K  [R0402]
R74  4.7K  [R0402]
R75  0R  [R0402]
R76  0R  [R0402]
R373  0R  [R0201]
R374  0R  [R0201]
R375  0R  [R0201]
R376  0R  [R0201]
R377  0R  [R0201]
R378  0R  [R0201]
R379  0R  [R0201]
R380  0R  [R0201]
R381  0R  [R0402]
R382  0R  [R0402]
R383  0R  [R0402]
R386  1M  [R0402]
R387  22R  [R0402]
U3  RTL8211F  [qfp_40p_r]
Y2  25MHz  [3225]

### Nets
1V05_AVDD_PHY1: C62.1 C63.1 C64.1 C65.1 R76.2 U3.3(AVDD10_2) U3.8(AVDD10_1) U3.38(AVDD10)
1V05_DVDD_PHY1: C60.1 C61.1 R75.1 U3.21(DVDD10)
1V05_PHY1: C52.1 C53.1 L7.2 R75.2 R76.1
1V8_DVDD_PHY1: C50.1 C51.1 C59.1 R48.1 R49.1 R50.1 R61.1 R62.1 R70.1 R381.1 U3.28(DVDD_RG)
3V3_AVDD_PHY1: C66.1 C67.1 C68.1 R383.1 U3.11(AVDD33_1) U3.40(AVDD33)
3V3_DVDD_PHY1: C69.1 C70.1 C71.1 R63.1 R64.2 R69.1 R73.2 R74.2 R382.1 U3.29(DVDD33)
CORE_VCC_1V8_S0: R381.2
GND: C50.2 C51.2 C52.2 C53.2 C54.2 C55.2 C56.2 C57.2 C58.2 C59.2 C60.2 C61.2 C62.2 C63.2 C64.2 C65.2 C66.2 C67.2 C68.2 C69.2 C70.2 C71.2 J7.10(CHS) R53.2 R58.2 R59.2 R60.2 R66.2 R68.2 R71.2 R72.2 U3.41(GND) Y2.2(GND1) Y2.4(GND2)
VCC_3V3_S0: R382.2 R383.2
GMAC0_MCLKINOUT: R67.1 R68.1 ; off-sheet GMAC0_MCLKINOUT
GMAC0_MCLKINOUT_R: R67.2 U3.35(CLKOUT)
GMAC0_MDC: R61.2 U3.13(MDC) ; off-sheet GMAC0_MDC
GMAC0_MDIO: R62.2 U3.14(MDIO) ; off-sheet GMAC0_MDIO
GMAC0_RSTn: D7.1 ; off-sheet GMAC0_RSTn
GMAC0_RXCLK: R56.1 R59.1 ; off-sheet GMAC0_RXCLK
GMAC0_RXCLK_R: R56.2 U3.27(RXC)
GMAC0_RXD0: R48.2 R51.1 ; off-sheet GMAC0_RXD0
GMAC0_RXD0_R: R51.2 U3.25(RXD0)
GMAC0_RXD1: R49.2 R52.1 ; off-sheet GMAC0_RXD1
GMAC0_RXD1_R: R52.2 U3.24(RXD1)
GMAC0_RXD2: R54.1 R58.1 ; off-sheet GMAC0_RXD2
GMAC0_RXD2_R: R54.2 U3.23(RXD2)
GMAC0_RXD3: R50.2 R55.1 ; off-sheet GMAC0_RXD3
GMAC0_RXD3_R: R55.2 U3.22(RXD3)
GMAC0_RXDV_CRS: R57.1 R60.1 ; off-sheet GMAC0_RXDV_CRS
GMAC0_RXDV_CRS_R: R57.2 U3.26(RXCTL)
GMAC0_TXCLK: U3.20(TXC) ; off-sheet GMAC0_TXCLK
GMAC0_TXD0: U3.18(TXD0) ; off-sheet GMAC0_TXD0
GMAC0_TXD1: U3.17(TXD1) ; off-sheet GMAC0_TXD1
GMAC0_TXD2: U3.16(TXD2) ; off-sheet GMAC0_TXD2
GMAC0_TXD3: U3.15(TXD3) ; off-sheet GMAC0_TXD3
GMAC0_TXEN: U3.19(TXCTL) ; off-sheet GMAC0_TXEN
MDIN0_PHY1: R374.1 U3.2(MDIN0)
MDIN0_PHY1_RJ45: J7.3(TD1-) R374.2
MDIN1_PHY1: R376.1 U3.5(MDIN1)
MDIN1_PHY1_RJ45: J7.7(RD1-) R376.2
MDIN2_PHY1: R378.1 U3.7(MDIN2)
MDIN2_PHY1_RJ45: J7.6(TD2-) R378.2
MDIN3_PHY1: R380.1 U3.10(MDIN3)
MDIN3_PHY1_RJ45: J7.9(RD2-) R380.2
MDIP0_PHY1: R373.1 U3.1(MDIP0)
MDIP0_PHY1_RJ45: J7.2(TD1+) R373.2
MDIP1_PHY1: R375.1 U3.4(MDIP1)
MDIP1_PHY1_RJ45: J7.4(RD1+) R375.2
MDIP2_PHY1: R377.1 U3.6(MDIP2)
MDIP2_PHY1_RJ45: J7.5(TD2+) R377.2
MDIP3_PHY1: R379.1 U3.9(MDIP3)
MDIP3_PHY1_RJ45: J7.8(RD2+) R379.2
PHY1_LED1: J7.14(YELA) R72.1 U3.33(LED1)
PHY1_LED2: J7.12(GRLC) R73.1 U3.34(LED2)
NetC54_1: C54.1 R387.1 Y2.1
NetC55_1: C55.1 R386.2 U3.36(XTAL_IN) Y2.3
NetC56_1: C56.1 J7.1(CT)
NetC57_1: C57.1 J7.15(SH) J7.16(SH1) R71.1
NetC58_1: C58.1 D7.2 R69.2 R70.2 U3.12(PHYRSTB)
NetJ7_11: J7.11(GRLA) R64.1
NetJ7_13: J7.13(YELC) R66.1
NetL7_1: L7.1 U3.30(REG_OUT)
NetR53_1: R53.1 U3.39(RSET)
NetR63_2: R63.2 U3.31(INTB)
NetR74_1: R74.1 U3.32(LED0)
NetR386_1: R386.1 R387.2 U3.37(XTAL_OUT)

### Notes on the sheet
- 以太网_eth1
- PHY Address : 001
- TXC / RXC : delays 2ns
- (near C50) L:<200mils
  W:>60mils
- (near R53) 1%
- L:<200mils
  W:>60mils
- L:<200mils
- W:>60mils
- GPIO3_C0
- R70
- R69
- JL2101-N040C
- 10K
- NC
- (near D7) RTL8211F
- IO使用外部电源：电压1.8V

### Library data of the parts
C50-C71 = CAP_NP
D7 = DIODE_SCHTKY
L7 = IND
R48-R64 R66-R76 R373-R383 R386 R387 = RES
Y2 = CRYSTAL_4P

## Sheet 5.USB3.SchDoc
size 420 x 297 mm; SheetNumber: 5; SheetTotal: 13
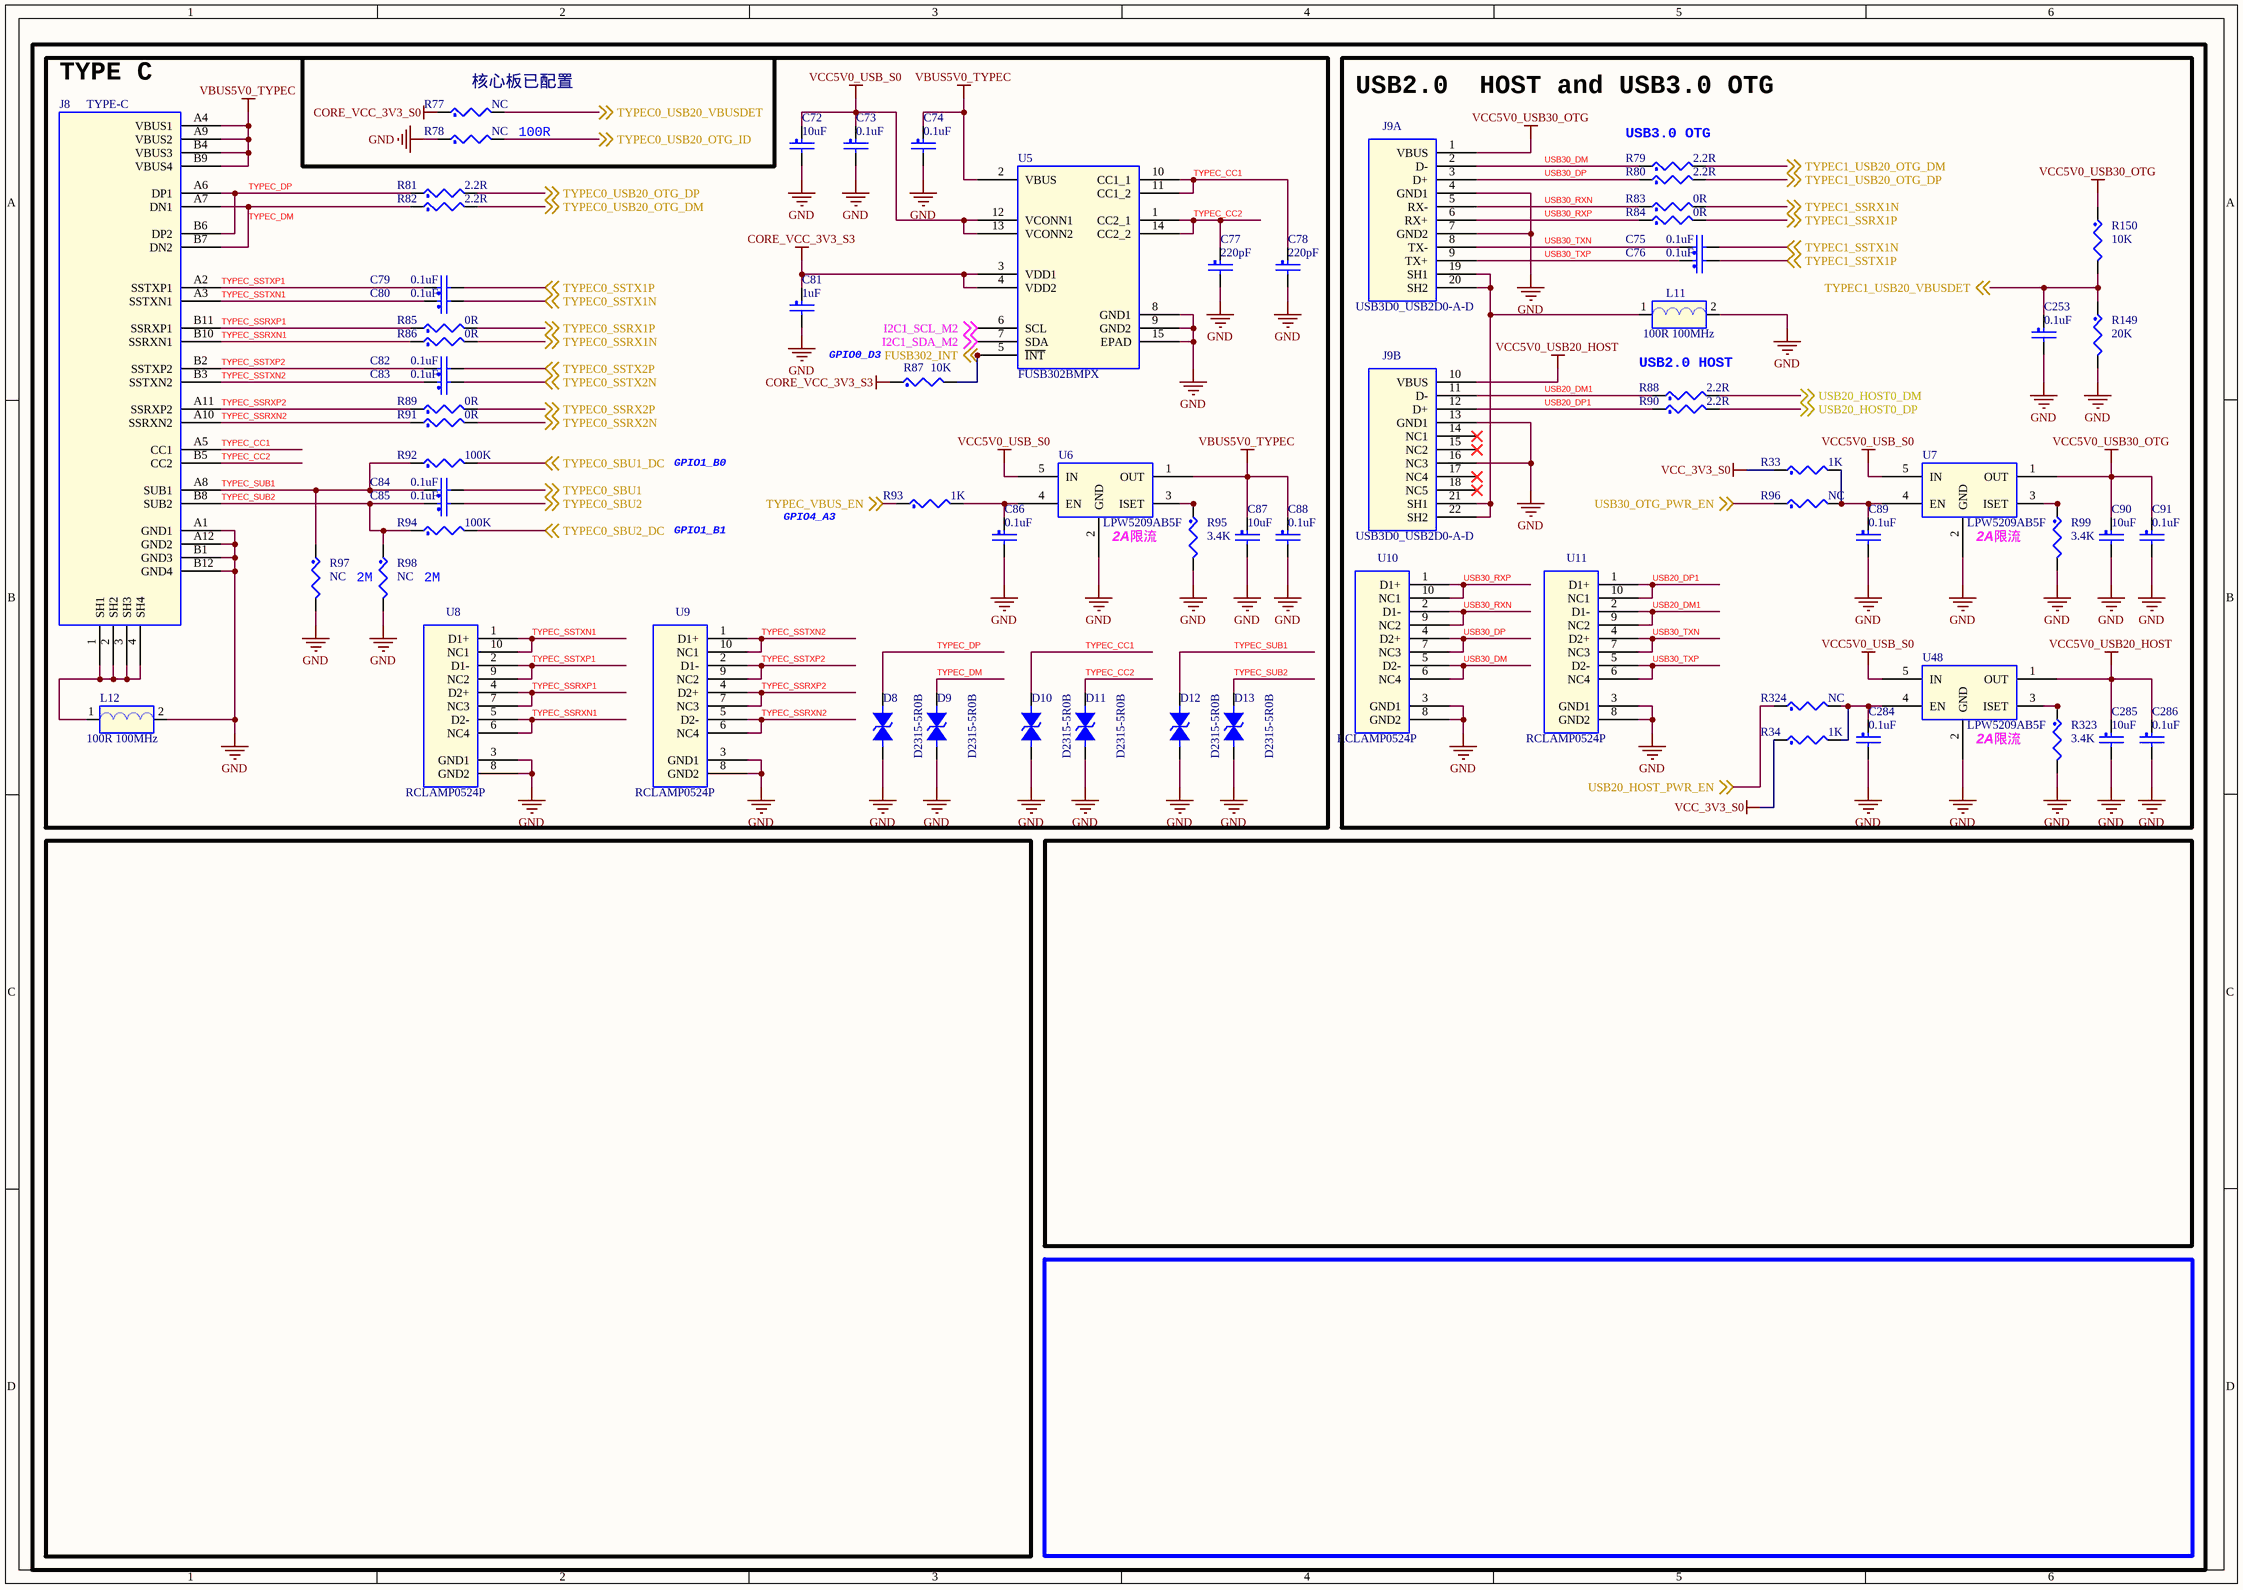
[diagram p4: 5.USB3.SchDoc]

### Parts
C72  10uF  [C0402]
C73  0.1uF  [C0402]
C74  0.1uF  [C0402]
C75  0.1uF  [C0402]
C76  0.1uF  [C0402]
C77  220pF  [C0402]
C78  220pF  [C0402]
C79  0.1uF  [C0402]
C80  0.1uF  [C0402]
C81  1uF  [C0402]
C82  0.1uF  [C0402]
C83  0.1uF  [C0402]
C84  0.1uF  [C0402]
C85  0.1uF  [C0402]
C86  0.1uF  [C0402]
C87  10uF  [C0402]
C88  0.1uF  [C0402]
C89  0.1uF  [C0402]
C90  10uF  [C0402]
C91  0.1uF  [C0402]
C253  0.1uF  [C0402]
C284  0.1uF  [C0402]
C285  10uF  [C0402]
C286  0.1uF  [C0402]
D8  D2315-5R0B  [esd0402]
D9  D2315-5R0B  [esd0402]
D10  D2315-5R0B  [esd0402]
D11  D2315-5R0B  [esd0402]
D12  D2315-5R0B  [esd0402]
D13  D2315-5R0B  [esd0402]
J8  TYPE-C  [usb-c-smd_tyc-324g]
J9  USB3D0_USB2D0-A-D  [USB3D0-AF-18P]  (parts A,B of 2)
L11  100R 100MHz  [L0603]
L12  100R 100MHz  [L0603]
R33  1K  [R0402]
R34  1K  [R0402]
R77  NC  [R0402]
R78  NC  [R0402]
R79  2.2R  [R0402]
R80  2.2R  [R0402]
R81  2.2R  [R0402]
R82  2.2R  [R0402]
R83  0R  [R0402]
R84  0R  [R0402]
R85  0R  [R0402]
R86  0R  [R0402]
R87  10K  [R0402]
R88  2.2R  [R0402]
R89  0R  [R0402]
R90  2.2R  [R0402]
R91  0R  [R0402]
R92  100K  [R0402]
R93  1K  [R0402]
R94  100K  [R0402]
R95  3.4K  [R0402]
R96  NC  [R0402]
R97  NC  [R0402]
R98  NC  [R0402]
R99  3.4K  [R0402]
R149  20K  [R0402]
R150  10K  [R0402]
R323  3.4K  [R0402]
R324  NC  [R0402]
U5  FUSB302BMPX  [WQFN14-0R50-2R5X2R5EP1R45X1R45]
U6  LPW5209AB5F  [SOT23-5]
U7  LPW5209AB5F  [SOT23-5]
U8  RCLAMP0524P  [USON_10]
U9  RCLAMP0524P  [USON_10]
U10  RCLAMP0524P  [USON_10]
U11  RCLAMP0524P  [USON_10]
U48  LPW5209AB5F  [SOT23-5]

### Blocks framed on the sheet
TYPE C: C72-C74 C77-C88 D8-D13 J8 L12 R77 R78 R81 R82 R85-R87 R89 R91-R95 R97 R98 U5 U6 U8 U9
USB2.0  HOST and USB3.0 OTG: C75 C76 C89-C91 C253 C284-C286 J9 L11 R33 R34 R79 R80 R83 R84 R88 R90 R96 R99 R149 R150 R323 R324 U7 U10 U11 U48

### Nets
CORE_VCC_3V3_S0: R77.1
CORE_VCC_3V3_S3: C81.1 R87.1 U5.3(VDD1) U5.4(VDD2)
GND: C72.2 C73.2 C74.2 C77.2 C78.2 C81.2 C86.2 C87.2 C88.2 C89.2 C90.2 C91.2 C253.2 C284.2 C285.2 C286.2 D8.1 D9.1 D10.1 D11.1 D12.1 D13.1 J8.A1(GND1) J8.A12(GND2) J8.B1(GND3) J8.B12(GND4) J9.4(GND1) J9.7(GND2) J9.13(GND1) J9.16(NC3) L11.2 L12.2 R78.1 R95.2 R97.2 R98.2 R99.2 R149.2 R323.2 U5.8(GND1) U5.9(GND2) U5.15(EPAD) U6.2(GND) U7.2(GND) U8.3(GND1) U8.8(GND2) U9.3(GND1) U9.8(GND2) U10.3(GND1) U10.8(GND2) U11.3(GND1) U11.8(GND2) U48.2(GND)
VBUS5V0_TYPEC: C74.1 C87.1 C88.1 J8.A4(VBUS1) J8.A9(VBUS2) J8.B4(VBUS3) J8.B9(VBUS4) U5.2(VBUS) U6.1(OUT)
VCC5V0_USB20_HOST: C285.1 C286.1 J9.10(VBUS) U48.1(OUT)
VCC5V0_USB30_OTG: C90.1 C91.1 J9.1(VBUS) R150.1 U7.1(OUT)
VCC5V0_USB_S0: C72.1 C73.1 U5.12(VCONN1) U5.13(VCONN2) U6.5(IN) U7.5(IN) U48.5(IN)
VCC_3V3_S0: R33.1 R34.1
FUSB302_INT: R87.2 U5.5(~{INT}) ; off-sheet FUSB302_INT
I2C1_SCL_M2: U5.6(SCL) ; off-sheet I2C1_SCL_M2
I2C1_SDA_M2: U5.7(SDA) ; off-sheet I2C1_SDA_M2
TYPEC0_SBU1: C84.2 ; off-sheet TYPEC0_SBU1
TYPEC0_SBU1_DC: R92.2 ; off-sheet TYPEC0_SBU1_DC  [project net GPIO1_B0]
TYPEC0_SBU2: C85.2 ; off-sheet TYPEC0_SBU2
TYPEC0_SBU2_DC: R94.2 ; off-sheet TYPEC0_SBU2_DC  [project net GPIO1_B1]
TYPEC0_SSRX1N: R86.2 ; off-sheet TYPEC0_SSRX1N
TYPEC0_SSRX1P: R85.2 ; off-sheet TYPEC0_SSRX1P
TYPEC0_SSRX2N: R91.2 ; off-sheet TYPEC0_SSRX2N
TYPEC0_SSRX2P: R89.2 ; off-sheet TYPEC0_SSRX2P
TYPEC0_SSTX1N: C80.2 ; off-sheet TYPEC0_SSTX1N
TYPEC0_SSTX1P: C79.2 ; off-sheet TYPEC0_SSTX1P
TYPEC0_SSTX2N: C83.2 ; off-sheet TYPEC0_SSTX2N
TYPEC0_SSTX2P: C82.2 ; off-sheet TYPEC0_SSTX2P
TYPEC0_USB20_OTG_DM: R82.2 ; off-sheet TYPEC0_USB20_OTG_DM
TYPEC0_USB20_OTG_DP: R81.2 ; off-sheet TYPEC0_USB20_OTG_DP
TYPEC0_USB20_OTG_ID: R78.2 ; off-sheet TYPEC0_USB20_OTG_ID
TYPEC0_USB20_VBUSDET: R77.2 ; off-sheet TYPEC0_USB20_VBUSDET
TYPEC1_SSRX1N: R83.2 ; off-sheet TYPEC1_SSRX1N
TYPEC1_SSRX1P: R84.2 ; off-sheet TYPEC1_SSRX1P
TYPEC1_SSTX1N: C75.2 ; off-sheet TYPEC1_SSTX1N
TYPEC1_SSTX1P: C76.2 ; off-sheet TYPEC1_SSTX1P
TYPEC1_USB20_OTG_DM: R79.2 ; off-sheet TYPEC1_USB20_OTG_DM
TYPEC1_USB20_OTG_DP: R80.2 ; off-sheet TYPEC1_USB20_OTG_DP
TYPEC1_USB20_VBUSDET: C253.1 R149.1 R150.2 ; off-sheet TYPEC1_USB20_VBUSDET
TYPEC_CC1: C78.1 D10.2 J8.A5(CC1) U5.10(CC1_1) U5.11(CC1_2)
TYPEC_CC2: C77.1 D11.2 J8.B5(CC2) U5.1(CC2_1) U5.14(CC2_2)
TYPEC_DM: D9.2 J8.A7(DN1) J8.B7(DN2) R82.1
TYPEC_DP: D8.2 J8.A6(DP1) J8.B6(DP2) R81.1
TYPEC_SSRXN1: J8.B10(SSRXN1) R86.1 U8.5(D2-) U8.6(NC4)
TYPEC_SSRXN2: J8.A10(SSRXN2) R91.1 U9.5(D2-) U9.6(NC4)
TYPEC_SSRXP1: J8.B11(SSRXP1) R85.1 U8.4(D2+) U8.7(NC3)
TYPEC_SSRXP2: J8.A11(SSRXP2) R89.1 U9.4(D2+) U9.7(NC3)
TYPEC_SSTXN1: C80.1 J8.A3(SSTXN1) U8.1(D1+) U8.10(NC1)
TYPEC_SSTXN2: C83.1 J8.B3(SSTXN2) U9.1(D1+) U9.10(NC1)
TYPEC_SSTXP1: C79.1 J8.A2(SSTXP1) U8.2(D1-) U8.9(NC2)
TYPEC_SSTXP2: C82.1 J8.B2(SSTXP2) U9.2(D1-) U9.9(NC2)
TYPEC_SUB1: C84.1 D12.2 J8.A8(SUB1) R92.1 R97.1
TYPEC_SUB2: C85.1 D13.2 J8.B8(SUB2) R94.1 R98.1
TYPEC_VBUS_EN: R93.1 ; off-sheet TYPEC_VBUS_EN  [project net GPIO4_A3]
USB20_DM1: J9.11(D-) R88.1 U11.2(D1-) U11.9(NC2)
USB20_DP1: J9.12(D+) R90.1 U11.1(D1+) U11.10(NC1)
USB20_HOST0_DM: R88.2 ; off-sheet USB20_HOST0_DM
USB20_HOST0_DP: R90.2 ; off-sheet USB20_HOST0_DP
USB20_HOST_PWR_EN: R324.1 ; off-sheet USB20_HOST_PWR_EN
USB30_DM: J9.2(D-) R79.1 U10.5(D2-) U10.6(NC4)
USB30_DP: J9.3(D+) R80.1 U10.4(D2+) U10.7(NC3)
USB30_OTG_PWR_EN: R96.1 ; off-sheet USB30_OTG_PWR_EN
USB30_RXN: J9.5(RX-) R83.1 U10.2(D1-) U10.9(NC2)
USB30_RXP: J9.6(RX+) R84.1 U10.1(D1+) U10.10(NC1)
USB30_TXN: C75.1 J9.8(TX-) U11.4(D2+) U11.7(NC3)
USB30_TXP: C76.1 J9.9(TX+) U11.5(D2-) U11.6(NC4)
NetC86_1: C86.1 R93.2 U6.4(EN)
NetC89_1: C89.1 R33.2 R96.2 U7.4(EN)
NetC284_1: C284.1 R34.2 R324.2 U48.4(EN)
NetJ8_1: J8.1(SH1) J8.2(SH2) J8.3(SH3) J8.4(SH4) L12.1
NetJ9_19: J9.19(SH1) J9.20(SH2) J9.21(SH1) J9.22(SH2) L11.1
NetR95_1: R95.1 U6.3(ISET)
NetR99_1: R99.1 U7.3(ISET)
NetR323_1: R323.1 U48.3(ISET)

Not connected (* = marked no-connect by the designer): J9 14(NC1)* 15(NC2)* 17(NC4)* 18(NC5)*

### Notes on the sheet
- (near R77) 核心板已配置
- 100R
- USB3.0 OTG
- GPIO0_D3
- USB2.0 HOST
- GPIO1_B0
- GPIO1_B1
- GPIO4_A3
- (near R98) 2M
- 2M
- (near U6) 2A限流
- (near U7) 2A限流
- (near U48) 2A限流

### Library data of the parts
C72-C91 C253 C284-C286 = CAP_NP
D8-D13 = DIODE BI-DIR TRIG
J8 = TYPE-C-24P
L11 L12 = BEAD
R33 R34 R77-R99 R149 R150 R323 R324 = RES

## Sheet 6.音频_FAN_ADC_LED.SchDoc
size 420 x 297 mm; SheetNumber: 6; SheetTotal: 13
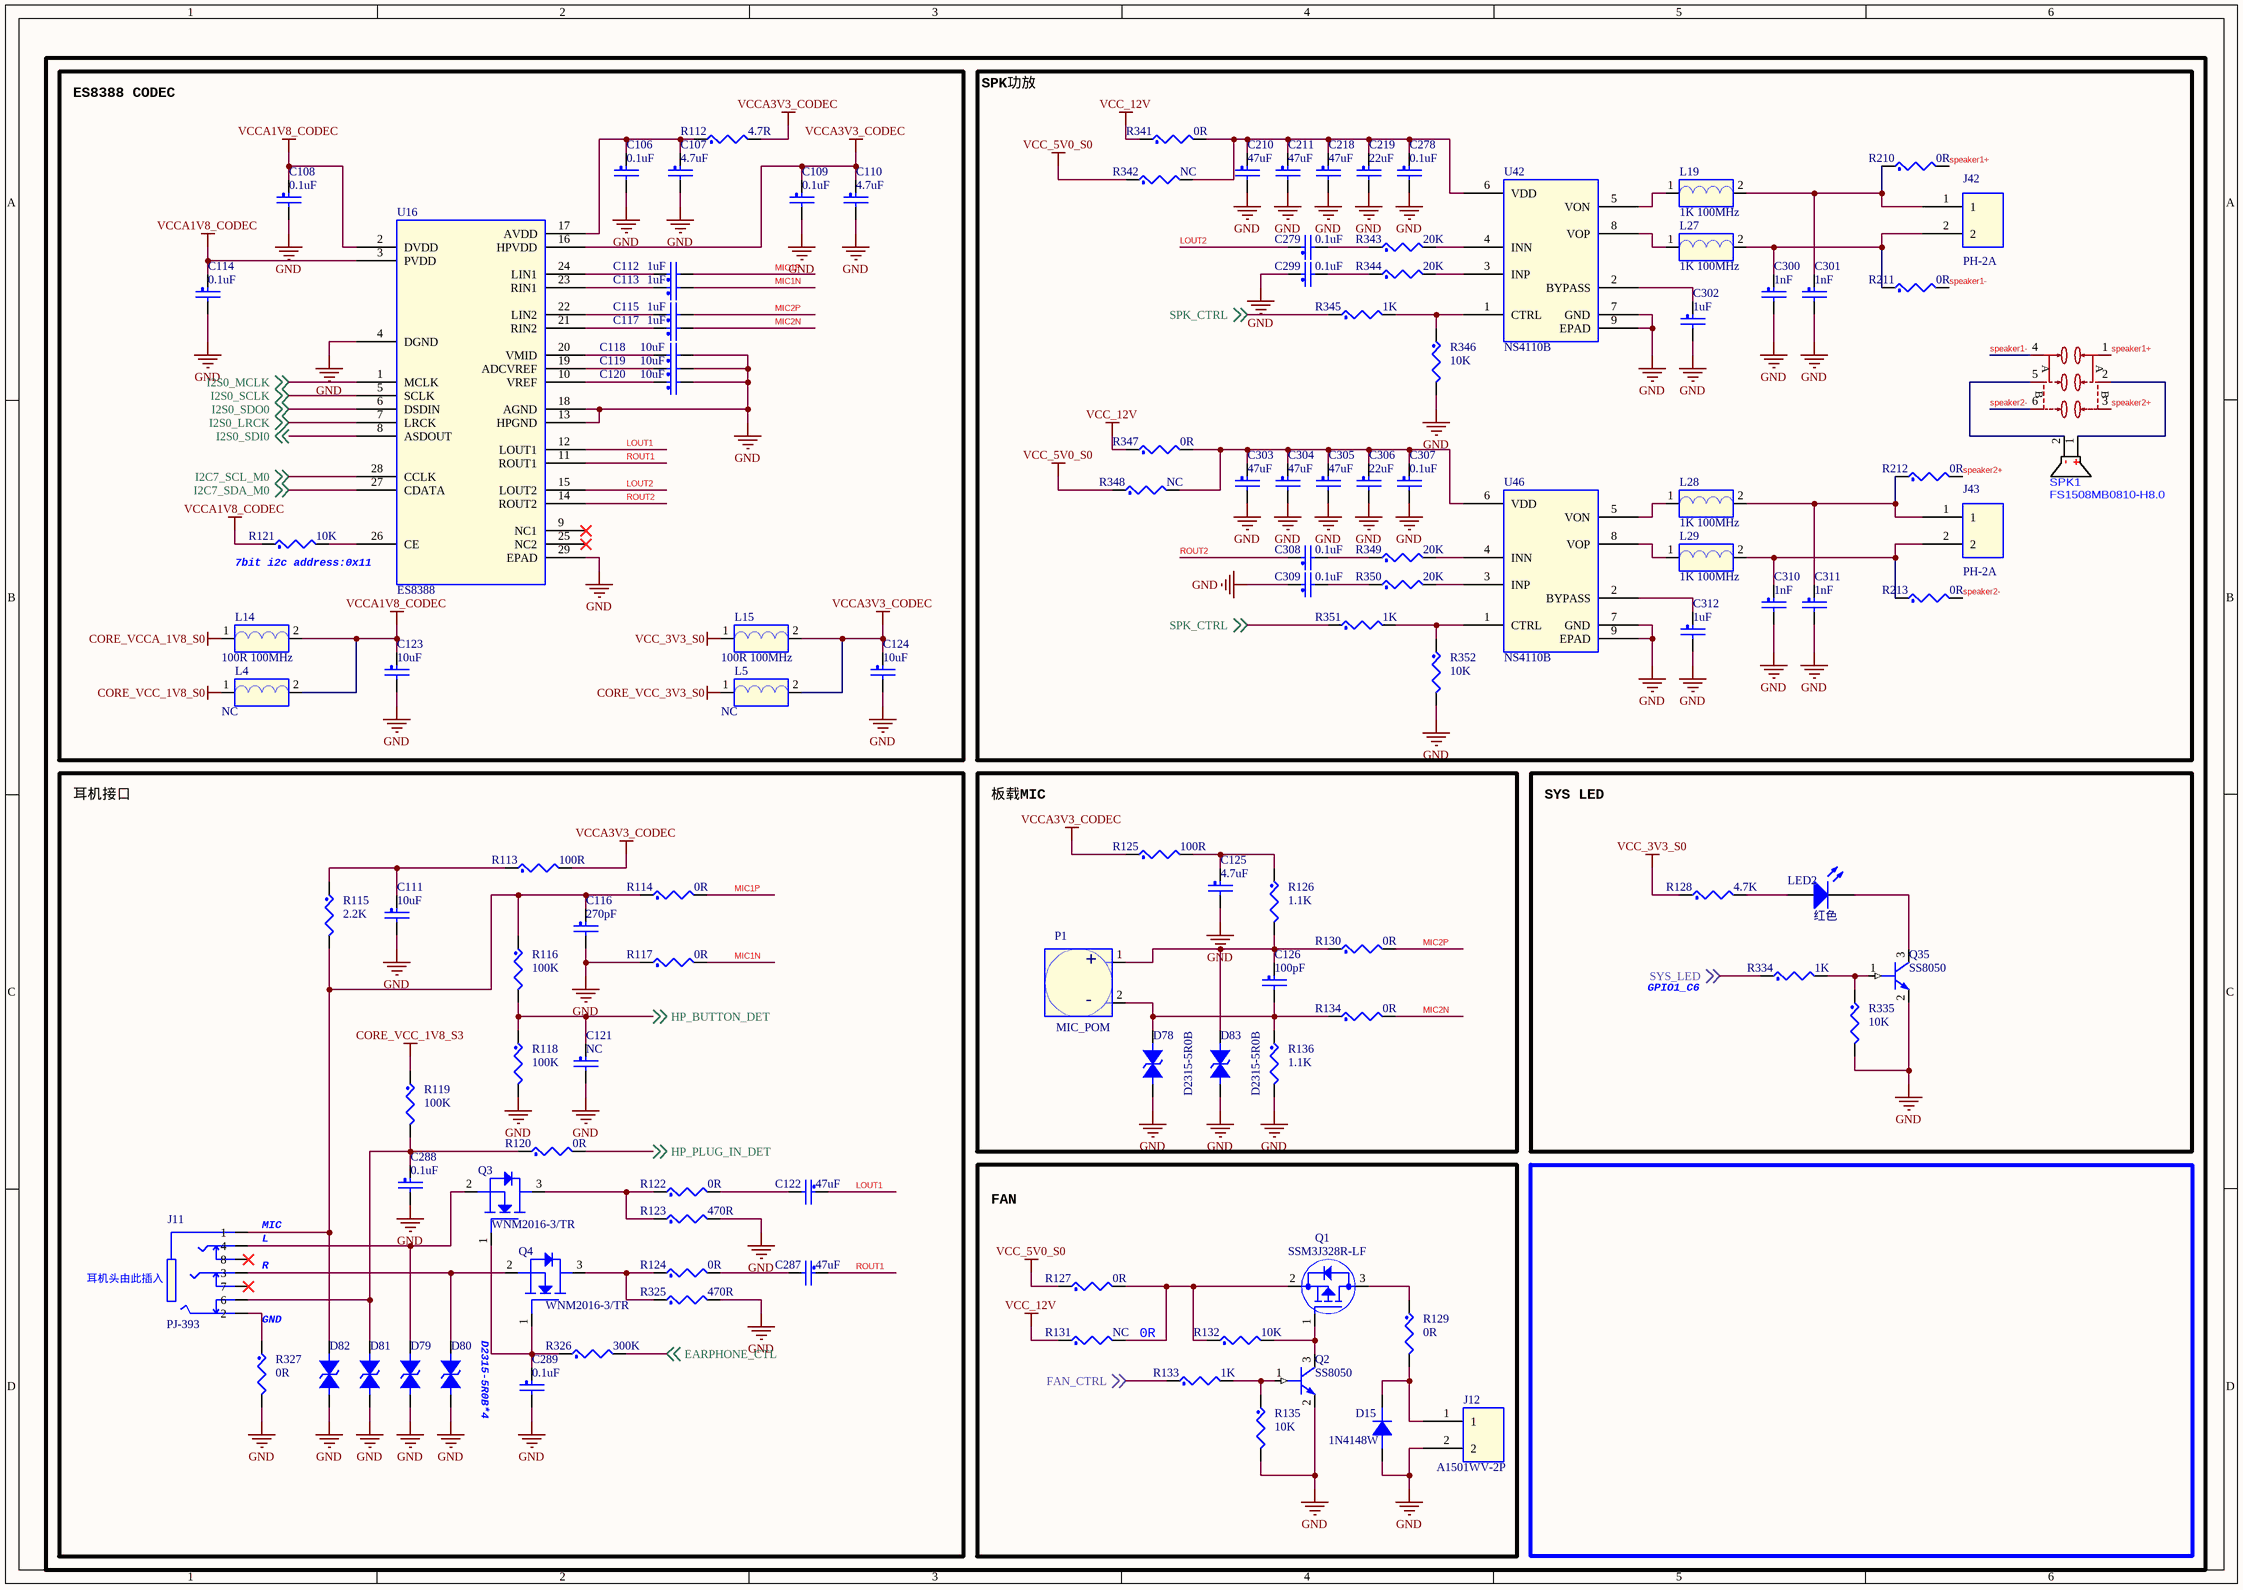
[diagram p5: 6.音频_FAN_ADC_LED.SchDoc]

### Parts
C106  0.1uF  [C0402]
C107  4.7uF  [C0402]
C108  0.1uF  [C0402]
C109  0.1uF  [C0402]
C110  4.7uF  [C0402]
C111  10uF  [C0402]
C112  1uF  [C0402]
C113  1uF  [C0402]
C114  0.1uF  [C0402]
C115  1uF  [C0402]
C116  270pF  [C0402]
C117  1uF  [C0402]
C118  10uF  [C0402]
C119  10uF  [C0402]
C120  10uF  [C0402]
C121  NC  [C0402]
C122  47uF  [C0603]
C123  10uF  [C0402]
C124  10uF  [C0402]
C125  4.7uF  [C0402]
C126  100pF  [C0402]
C210  47uF  [C1206]
C211  47uF  [C1206]
C218  47uF  [C1206]
C219  22uF  [C0805]
C278  0.1uF  [C0402]
C279  0.1uF  [C0402]
C287  47uF  [C0603]
C288  0.1uF  [C0402]
C289  0.1uF  [C0402]
C299  0.1uF  [C0402]
C300  1nF  [C0402]
C301  1nF  [C0402]
C302  1uF  [C0402]
C303  47uF  [C1206]
C304  47uF  [C1206]
C305  47uF  [C1206]
C306  22uF  [C0805]
C307  0.1uF  [C0402]
C308  0.1uF  [C0402]
C309  0.1uF  [C0402]
C310  1nF  [C0402]
C311  1nF  [C0402]
C312  1uF  [C0402]
D15  1N4148W  [SOD-123]
D78  D2315-5R0B  [esd0402]
D79  D2315-5R0B  [esd0402]  (value not drawn)
D80  D2315-5R0B  [esd0402]  (value not drawn)
D81  D2315-5R0B  [esd0402]  (value not drawn)
D82  D2315-5R0B  [esd0402]  (value not drawn)
D83  D2315-5R0B  [esd0402]
J11  PJ-393  [audio_smd_7p_6r0x8r8]
J12  A1501WV-2P  [zh1p5mm_th_2p]
J42  PH-2A  [PH-1x2-2P0_l]
J43  PH-2A  [PH-1x2-2P0_l]
L4  NC  [L0603]
L5  NC  [L0603]
L14  100R 100MHz  [L0603]
L15  100R 100MHz  [L0603]
L19  1K 100MHz  [L0603]
L27  1K 100MHz  [L0603]
L28  1K 100MHz  [L0603]
L29  1K 100MHz  [L0603]
LED2  红色  [LED0603_R]
P1  MIC_POM  [MIC2-4R00-TM]
Q1  SSM3J328R-LF  [SOT23]
Q2  SS8050  [SOT23]
Q3  WNM2016-3/TR  [SOT23]
Q4  WNM2016-3/TR  [SOT23]
Q35  SS8050  [SOT23]
R112  4.7R  [R0402]
R113  100R  [R0402]
R114  0R  [R0402]
R115  2.2K  [R0402]
R116  100K  [R0402]
R117  0R  [R0402]
R118  100K  [R0402]
R119  100K  [R0402]
R120  0R  [R0402]
R121  10K  [R0402]
R122  0R  [R0402]
R123  470R  [R0402]
R124  0R  [R0402]
R125  100R  [R0402]
R126  1.1K  [R0402]
R127  0R  [R0805]
R128  4.7K  [R0402]
R129  0R  [R0805]
R130  0R  [R0402]
R131  NC  [R0805]
R132  10K  [R0402]
R133  1K  [R0402]
R134  0R  [R0402]
R135  10K  [R0402]
R136  1.1K  [R0402]
R210  0R  [R0805]
R211  0R  [R0805]
R212  0R  [R0805]
R213  0R  [R0805]
R325  470R  [R0402]
R326  300K  [R0402]
R327  0R  [R0402]
R334  1K  [R0402]
R335  10K  [R0402]
R341  0R  [R0603]
R342  NC  [R0603]
R343  20K  [R0402]
R344  20K  [R0402]
R345  1K  [R0402]
R346  10K  [R0402]
R347  0R  [R0603]
R348  NC  [R0603]
R349  20K  [R0402]
R350  20K  [R0402]
R351  1K  [R0402]
R352  10K  [R0402]
SPK1  FS1508MB0810-H8.0  [BEEP-TH_BD15.0-P10.20-D1.2]
SW5  MST22D18G2  [SW-SMD_MST22D18G2]  (value not drawn)
U16  ES8388  [qfn28_0r45-4x4EP2R6X2R6]
U42  NS4110B  [SOP-8-EP-2R5X3R4]
U46  NS4110B  [SOP-8-EP-2R5X3R4]

### Blocks framed on the sheet
ES8388 CODEC: C106-C110 C112-C115 C117-C120 C123 C124 L4 L5 L14 L15 R112 R121 U16
SPK功放: C210 C211 C218 C219 C278 C279 C299-C312 J42 J43 L19 L27-L29 R210-R213 R341-R352 SPK1 SW5 U42 U46
耳机接口: C111 C116 C121 C122 C287-C289 D79-D82 J11 Q3 Q4 R113-R120 R122-R124 R325-R327
板载MIC: C125 C126 D78 D83 P1 R125 R126 R130 R134 R136
SYS LED: LED2 Q35 R128 R334 R335
FAN: D15 J12 Q1 Q2 R127 R129 R131-R133 R135

### Nets
CORE_VCC_1V8_S0: L4.1
CORE_VCC_1V8_S3: R119.1
CORE_VCC_3V3_S0: L5.1
CORE_VCCA_1V8_S0: L14.1
GND: C106.2 C107.2 C108.2 C109.2 C110.2 C111.2 C114.2 C116.2 C118.2 C119.2 C120.2 C121.2 C123.2 C124.2 C125.2 C210.2 C211.2 C218.2 C219.2 C278.2 C288.2 C289.2 C299.1 C300.2 C301.2 C302.2 C303.2 C304.2 C305.2 C306.2 C307.2 C309.1 C310.2 C311.2 C312.2 D15.2(A) D78.1 D79.1 D80.1 D81.1 D82.1 D83.1 J12.2 Q2.2(EMITTER) Q35.2(EMITTER) R117.1 R118.2 R123.2 R135.2 R136.2 R325.2 R327.2 R335.2 R346.2 R352.2 U16.4(DGND) U16.13(HPGND) U16.18(AGND) U16.29(EPAD) U42.7(GND) U42.9(EPAD) U46.7(GND) U46.9(EPAD)
VCC_3V3_S0: L15.1 R128.1
VCC_5V0_S0: R127.1 R342.1 R348.1
VCC_12V: R131.1 R341.1 R347.1
VCCA1V8_CODEC: C108.1 C114.1 C123.1 L4.2 L14.2 R121.1 U16.2(DVDD) U16.3(PVDD)
VCCA3V3_CODEC: C109.1 C110.1 C124.1 L5.2 L15.2 R112.2 R113.2 R125.1 U16.16(HPVDD)
EARPHONE_CTL: R326.2 ; off-sheet EARPHONE_CTL
FAN_CTRL: R133.1 ; off-sheet FAN_CTRL
HP_BUTTON_DET: C121.1 R116.2 R118.1 ; off-sheet HP_BUTTON_DET
HP_PLUG_IN_DET: R120.2 ; off-sheet HP_PLUG_IN_DET  [project net GPIO0_A0]
I2C7_SCL_M0: U16.28(CCLK) ; off-sheet I2C7_SCL_M0
I2C7_SDA_M0: U16.27(CDATA) ; off-sheet I2C7_SDA_M0
I2S0_LRCK: U16.7(LRCK) ; off-sheet I2S0_LRCK
I2S0_MCLK: U16.1(MCLK) ; off-sheet I2S0_MCLK
I2S0_SCLK: U16.5(SCLK) ; off-sheet I2S0_SCLK
I2S0_SDI0: U16.8(ASDOUT) ; off-sheet I2S0_SDI0
I2S0_SDO0: U16.6(DSDIN) ; off-sheet I2S0_SDO0
LOUT1: C122.1 U16.12(LOUT1)
LOUT2: C279.1 U16.15(LOUT2)
MIC1N: C113.2 R117.2
MIC1P: C112.2 R114.2
MIC2N: C117.2 R134.2
MIC2P: C115.2 R130.2
ROUT1: C287.1 U16.11(ROUT1)
ROUT2: C308.1 U16.14(ROUT2)
speaker1+: R210.2 SW5.1
speaker1-: R211.2 SW5.4
speaker2+: R212.2 SW5.3
speaker2-: R213.2 SW5.6
SPK_CTRL: R345.1 R351.1 ; off-sheet SPK_CTRL  [project net GPIO3_D5]
SYS_LED: R334.1 ; off-sheet SYS_LED  [project net GPIO1_C6]
NetC106_1: C106.1 C107.1 R112.1 U16.17(AVDD)
NetC111_1: C111.1 R113.1 R115.1
NetC112_1: C112.1 U16.24(LIN1)
NetC113_1: C113.1 U16.23(RIN1)
NetC115_1: C115.1 U16.22(LIN2)
NetC116_1: C116.1 D82.2 J11.1 R114.1 R115.2 R116.1
NetC117_1: C117.1 U16.21(RIN2)
NetC118_1: C118.1 U16.20(VMID)
NetC119_1: C119.1 U16.19(ADCVREF)
NetC120_1: C120.1 U16.10(VREF)
NetC122_2: C122.2 R122.2
NetC125_1: C125.1 R125.2 R126.1
NetC126_1: C126.1 D83.2 P1.1(Out) R126.2 R130.1
NetC126_2: C126.2 D78.2 P1.2(GND) R134.1 R136.1
NetC210_1: C210.1 C211.1 C218.1 C219.1 C278.1 R341.2 R342.2 U42.6(VDD)
NetC279_2: C279.2 R343.1
NetC287_2: C287.2 R124.2
NetC288_1: C288.1 D81.2 J11.6 R119.2 R120.1
NetC289_1: C289.1 Q3.1(GATE) Q4.1(GATE) R326.1
NetC299_2: C299.2 R344.1
NetC300_1: C300.1 J42.2 L27.2 R211.1
NetC301_1: C301.1 J42.1 L19.2 R210.1
NetC302_1: C302.1 U42.2(BYPASS)
NetC303_1: C303.1 C304.1 C305.1 C306.1 C307.1 R347.2 R348.2 U46.6(VDD)
NetC308_2: C308.2 R349.1
NetC309_2: C309.2 R350.1
NetC310_1: C310.1 J43.2 L29.2 R213.1
NetC311_1: C311.1 J43.1 L28.2 R212.1
NetC312_1: C312.1 U46.2(BYPASS)
NetD15_1: D15.1(K) J12.1 R129.2
NetD79_2: D79.2 J11.4 Q3.2(SOURCE)
NetD80_2: D80.2 J11.3 Q4.2(SOURCE)
NetJ11_2: J11.2 R327.1
NetL19_1: L19.1 U42.5(VON)
NetL27_1: L27.1 U42.8(VOP)
NetL28_1: L28.1 U46.5(VON)
NetL29_1: L29.1 U46.8(VOP)
NetLED2_1: LED2.1(A) R128.2
NetLED2_2: LED2.2(K) Q35.3(COLLECTOR)
NetQ1_1: Q1.1(GATE) Q2.3(COLLECTOR) R132.2
NetQ1_2: Q1.2(SOURCE) R127.2 R131.2 R132.1
NetQ1_3: Q1.3(DRAIN) R129.1
NetQ2_1: Q2.1(BASE) R133.2 R135.1
NetQ3_3: Q3.3(DRAIN) R122.1 R123.1
NetQ4_3: Q4.3(DRAIN) R124.1 R325.1
NetQ35_1: Q35.1(BASE) R334.2 R335.1
NetR121_2: R121.2 U16.26(CE)
NetR343_2: R343.2 U42.4(INN)
NetR344_2: R344.2 U42.3(INP)
NetR345_2: R345.2 R346.1 U42.1(CTRL)
NetR349_2: R349.2 U46.4(INN)
NetR350_2: R350.2 U46.3(INP)
NetR351_2: R351.2 R352.1 U46.1(CTRL)
NetSPK1_1: SPK1.1 SW5.2
NetSPK1_2: SPK1.2 SW5.5

Not connected (* = marked no-connect by the designer): J11 7* 8*; U16 9(NC1)* 25(NC2)*

### Notes on the sheet
- (near R121) 7bit i2c address:0x11
- GPIO1_C6
- (near J11) MIC
- (near J11) R
- (near J11) L
- 耳机头由此插入
- GND
- D2315-5R0B*4
- (near R131) 0R
- (in symbol MIC_POM) +; -
- (in symbol MST22D18G2) A; B

### Library data of the parts
C106-C126 C210 C211 C218 C219 C278 C279 C287-C289 C299-C312 = CAP_NP
D15 = DIODE
D78-D83 = DIODE BI-DIR TRIG
J12 J42 J43 = 1X2PIN
L4 L5 L14 L15 L19 L27-L29 = BEAD
LED2 = LED: 贴片LED
Q1 = MOSFET_P
Q2 Q35 = NPN
Q3 Q4 = MOSFET N
R112-R136 R210-R213 R325-R327 R334 R335 R341-R352 = RES

## Sheet 7.HDMI2.SchDoc
size 297 x 209 mm; SheetNumber: 7; SheetTotal: 13
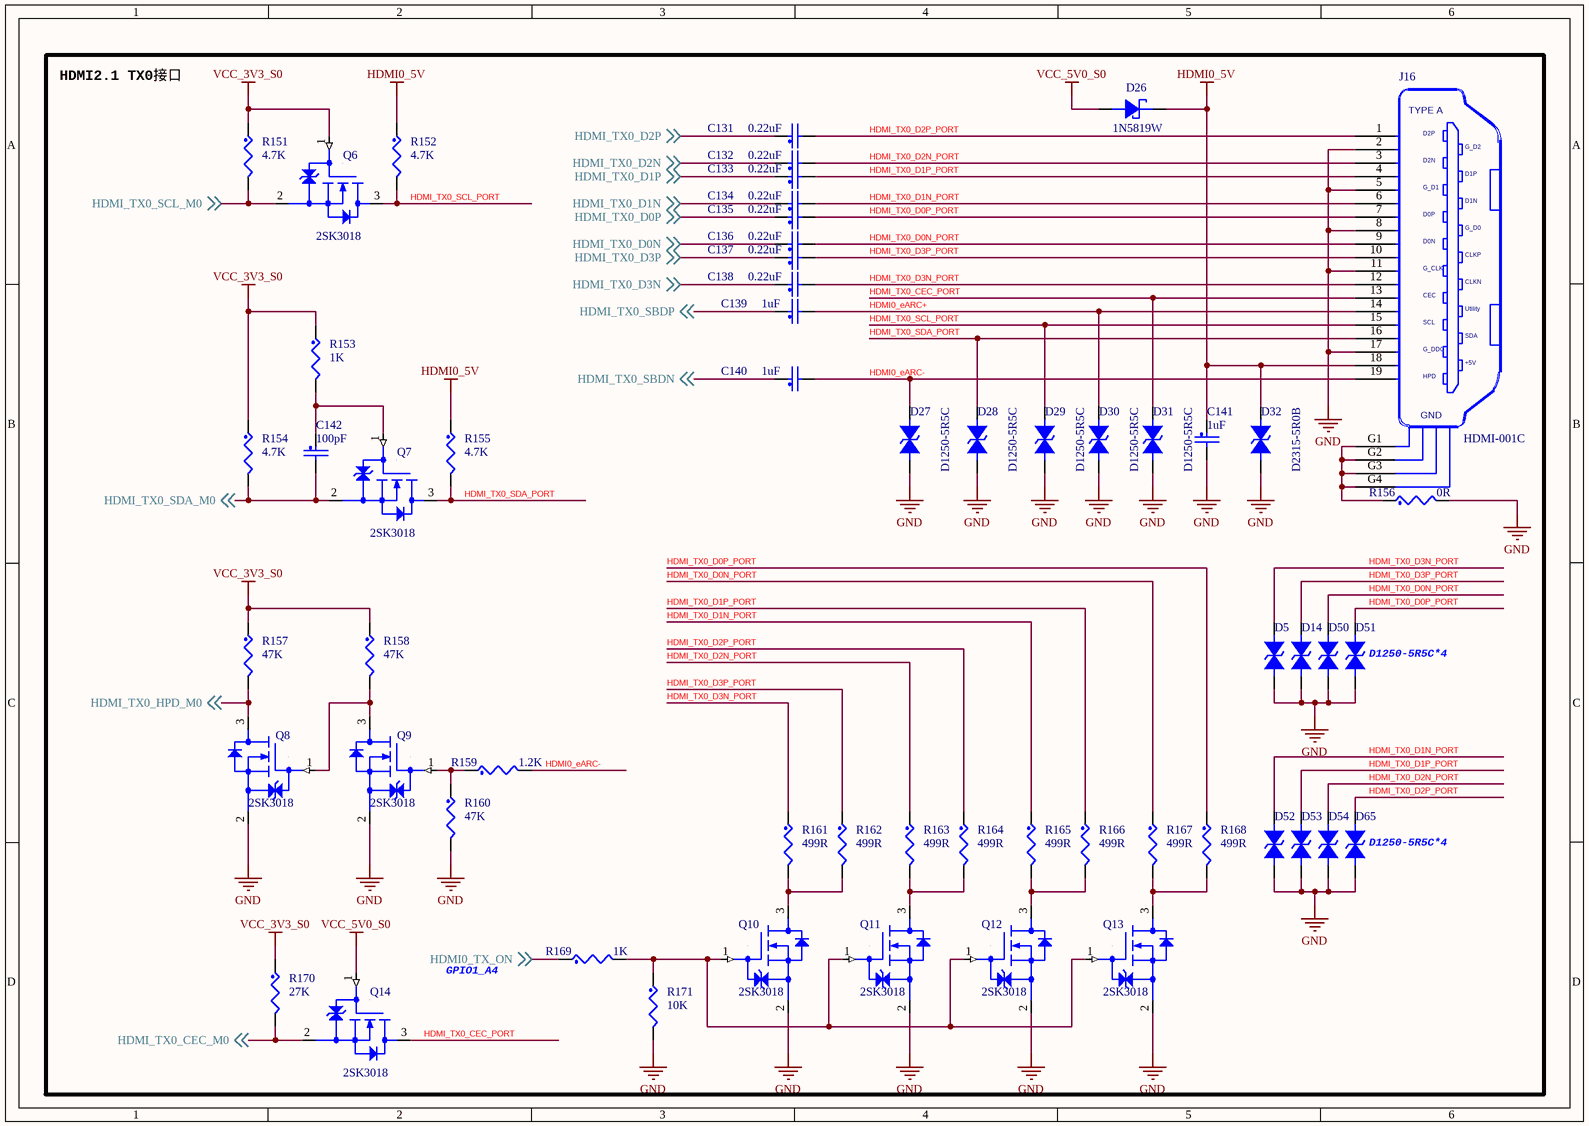
[diagram p6: 7.HDMI2.SchDoc]

### Parts
C131  0.22uF  [C0402]
C132  0.22uF  [C0402]
C133  0.22uF  [C0402]
C134  0.22uF  [C0402]
C135  0.22uF  [C0402]
C136  0.22uF  [C0402]
C137  0.22uF  [C0402]
C138  0.22uF  [C0402]
C139  1uF  [C0402]
C140  1uF  [C0402]
C141  1uF  [C0402]
C142  100pF  [C0402]
D5  D1250-5R5C  [esd0402]  (value not drawn)
D14  D1250-5R5C  [esd0402]  (value not drawn)
D26  1N5819W  [SOD-123]
D27  D1250-5R5C  [esd0402]
D28  D1250-5R5C  [esd0402]
D29  D1250-5R5C  [esd0402]
D30  D1250-5R5C  [esd0402]
D31  D1250-5R5C  [esd0402]
D32  D2315-5R0B  [esd0402]
D50  D1250-5R5C  [esd0402]  (value not drawn)
D51  D1250-5R5C  [esd0402]  (value not drawn)
D52  D1250-5R5C  [esd0402]  (value not drawn)
D53  D1250-5R5C  [esd0402]  (value not drawn)
D54  D1250-5R5C  [esd0402]  (value not drawn)
D65  D1250-5R5C  [esd0402]  (value not drawn)
J16  HDMI-001C  [HDMI-SMD]
Q6  2SK3018  [SOT23]
Q7  2SK3018  [SOT23]
Q8  2SK3018  [SOT23]
Q9  2SK3018  [SOT23]
Q10  2SK3018  [SOT23]
Q11  2SK3018  [SOT23]
Q12  2SK3018  [SOT23]
Q13  2SK3018  [SOT23]
Q14  2SK3018  [SOT23]
R151  4.7K  [R0402]
R152  4.7K  [R0402]
R153  1K  [R0402]
R154  4.7K  [R0402]
R155  4.7K  [R0402]
R156  0R  [R0402]
R157  47K  [R0402]
R158  47K  [R0402]
R159  1.2K  [R0402]
R160  47K  [R0402]
R161  499R  [R0402]
R162  499R  [R0402]
R163  499R  [R0402]
R164  499R  [R0402]
R165  499R  [R0402]
R166  499R  [R0402]
R167  499R  [R0402]
R168  499R  [R0402]
R169  1K  [R0402]
R170  27K  [R0402]
R171  10K  [R0402]

### Nets
GND: C141.2 D5.1 D14.1 D27.1 D28.1 D29.1 D30.1 D31.1 D32.1 D50.1 D51.1 D52.1 D53.1 D54.1 D65.1 J16.2 J16.5 J16.8 J16.11 J16.17 Q8.2(SOURCE) Q9.2(SOURCE) Q10.2(SOURCE) Q11.2(SOURCE) Q12.2(SOURCE) Q13.2(SOURCE) R156.2 R160.2 R171.2
HDMI0_5V: C141.1 D26.1 D32.2 J16.18 R152.1 R155.1
VCC_3V3_S0: Q6.1(GATE) R151.1 R153.1 R154.1 R157.1 R158.1 R170.1
VCC_5V0_S0: D26.2 Q14.1(GATE)
HDMI0_eARC+: C139.2 D30.2 J16.14
HDMI0_eARC-: C140.2 D27.2 J16.19 R159.2
HDMI0_TX_ON: R169.1 ; off-sheet HDMI0_TX_ON  [project net GPIO1_A4]
HDMI_TX0_CEC_M0: Q14.2(SOURCE) R170.2 ; off-sheet HDMI_TX0_CEC_M0
HDMI_TX0_CEC_PORT: D31.2 J16.13 Q14.3(DRAIN)
HDMI_TX0_D0N: C136.1 ; off-sheet HDMI_TX0_D0N
HDMI_TX0_D0N_PORT: C136.2 D50.2 J16.9 R167.1
HDMI_TX0_D0P: C135.1 ; off-sheet HDMI_TX0_D0P
HDMI_TX0_D0P_PORT: C135.2 D51.2 J16.7 R168.1
HDMI_TX0_D1N: C134.1 ; off-sheet HDMI_TX0_D1N
HDMI_TX0_D1N_PORT: C134.2 D52.2 J16.6 R165.1
HDMI_TX0_D1P: C133.1 ; off-sheet HDMI_TX0_D1P
HDMI_TX0_D1P_PORT: C133.2 D53.2 J16.4 R166.1
HDMI_TX0_D2N: C132.1 ; off-sheet HDMI_TX0_D2N
HDMI_TX0_D2N_PORT: C132.2 D54.2 J16.3 R163.1
HDMI_TX0_D2P: C131.1 ; off-sheet HDMI_TX0_D2P
HDMI_TX0_D2P_PORT: C131.2 D65.2 J16.1 R164.1
HDMI_TX0_D3N: C138.1 ; off-sheet HDMI_TX0_D3N
HDMI_TX0_D3N_PORT: C138.2 D5.2 J16.12 R161.1
HDMI_TX0_D3P: C137.1 ; off-sheet HDMI_TX0_D3P
HDMI_TX0_D3P_PORT: C137.2 D14.2 J16.10 R162.1
HDMI_TX0_HPD_M0: Q8.3(DRAIN) R157.2 ; off-sheet HDMI_TX0_HPD_M0
HDMI_TX0_SBDN: C140.1 ; off-sheet HDMI_TX0_SBDN
HDMI_TX0_SBDP: C139.1 ; off-sheet HDMI_TX0_SBDP
HDMI_TX0_SCL_M0: Q6.2(SOURCE) R151.2 ; off-sheet HDMI_TX0_SCL_M0
HDMI_TX0_SCL_PORT: D29.2 J16.15 Q6.3(DRAIN) R152.2
HDMI_TX0_SDA_M0: C142.2 Q7.2(SOURCE) R154.2 ; off-sheet HDMI_TX0_SDA_M0
HDMI_TX0_SDA_PORT: D28.2 J16.16 Q7.3(DRAIN) R155.2
NetC142_1: C142.1 Q7.1(GATE) R153.2
NetJ16_G1: J16.G1 J16.G2 J16.G3 J16.G4 R156.1
NetQ8_1: Q8.1(GATE) Q9.3(DRAIN) R158.2
NetQ9_1: Q9.1(GATE) R159.1 R160.1
NetQ10_1: Q10.1(GATE) Q11.1(GATE) Q12.1(GATE) Q13.1(GATE) R169.2 R171.1
NetQ10_3: Q10.3(DRAIN) R161.2 R162.2
NetQ11_3: Q11.3(DRAIN) R163.2 R164.2
NetQ12_3: Q12.3(DRAIN) R165.2 R166.2
NetQ13_3: Q13.3(DRAIN) R167.2 R168.2

### Notes on the sheet
- HDMI2.1 TX0接口
- (near D51) D1250-5R5C*4
- (near D65) D1250-5R5C*4
- (near Q14) GPIO1_A4
- (in symbol HDMI-001C) TYPE A; D2P; G_D2; D2N; D1P; G_D1; D1N; D0P; G_D0; D0N; CLKP; G_CLK; CLKN; CEC; Utility; SCL; SDA; G_DDC; +5V; HPD; GND

### Library data of the parts
C131-C142 = CAP_NP
D5 D14 D27-D32 D50-D54 D65 = DIODE BI-DIR TRIG
D26 = DIODE_SCHTKY
R151-R171 = RES

## Sheet 8.HDMI2.SchDoc
size 297 x 209 mm; SheetNumber: 8; SheetTotal: 13
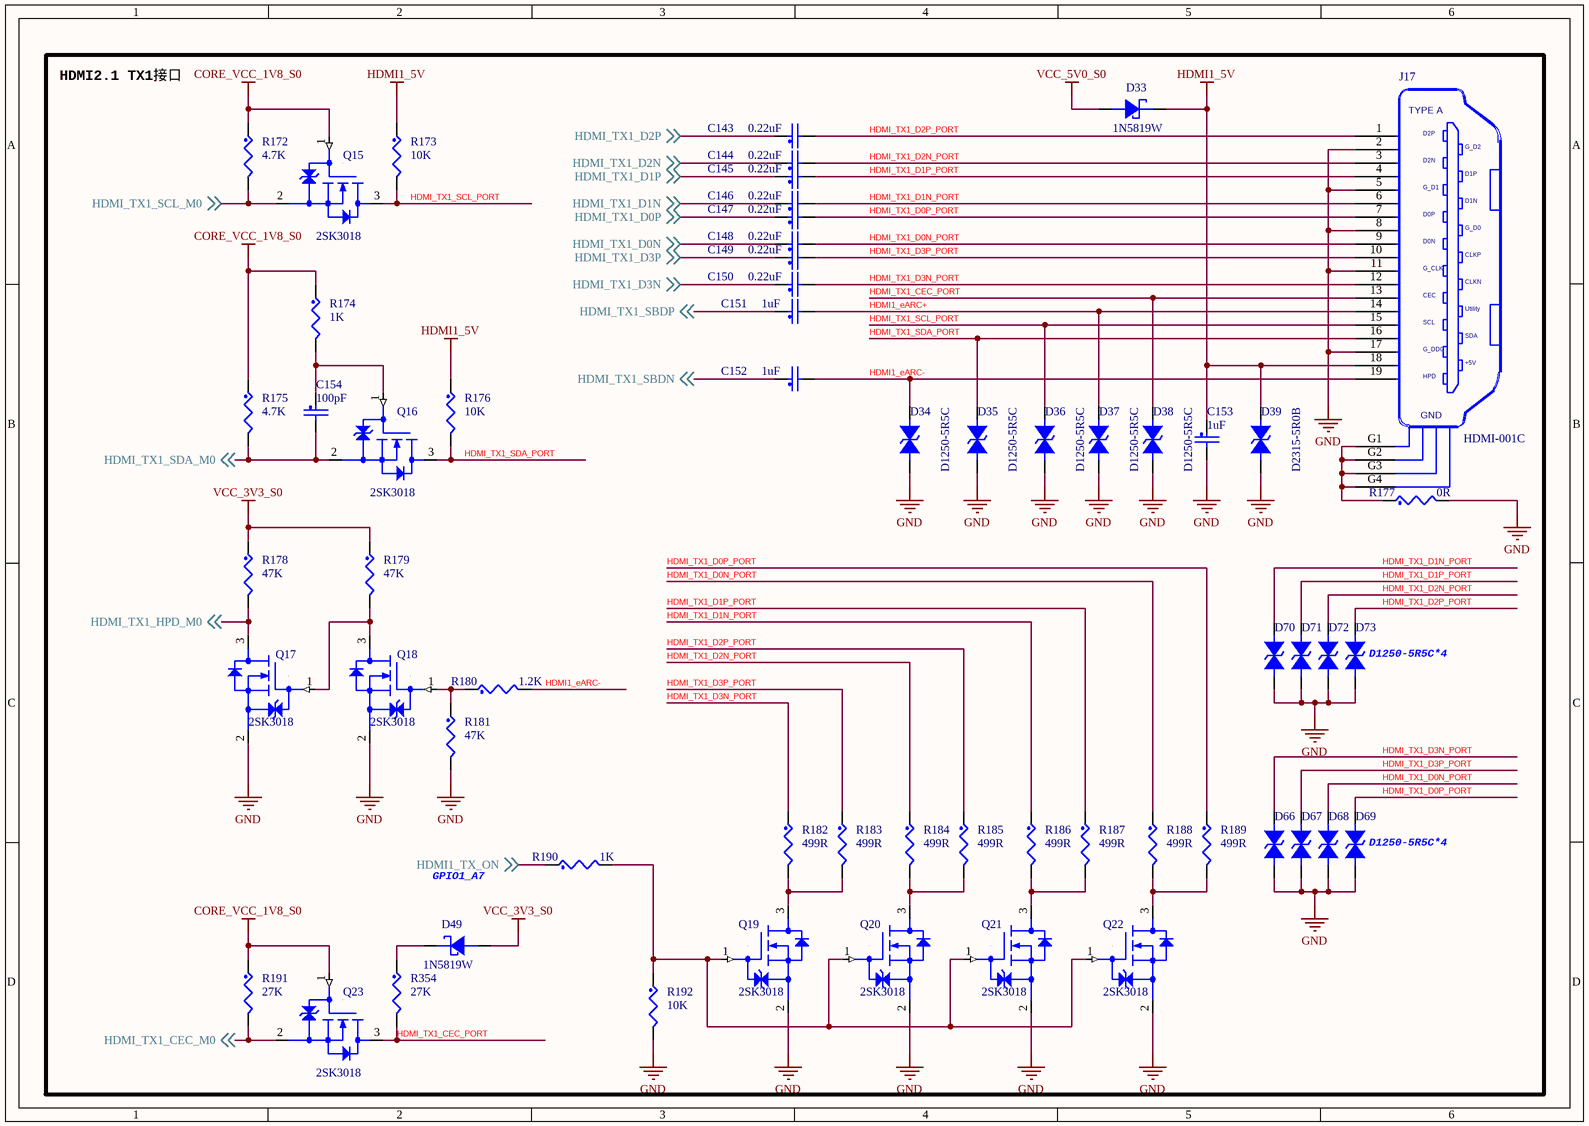
[diagram p7: 8.HDMI2.SchDoc]

### Parts
C143  0.22uF  [C0402]
C144  0.22uF  [C0402]
C145  0.22uF  [C0402]
C146  0.22uF  [C0402]
C147  0.22uF  [C0402]
C148  0.22uF  [C0402]
C149  0.22uF  [C0402]
C150  0.22uF  [C0402]
C151  1uF  [C0402]
C152  1uF  [C0402]
C153  1uF  [C0402]
C154  100pF  [C0402]
D33  1N5819W  [SOD-123]
D34  D1250-5R5C  [esd0402]
D35  D1250-5R5C  [esd0402]
D36  D1250-5R5C  [esd0402]
D37  D1250-5R5C  [esd0402]
D38  D1250-5R5C  [esd0402]
D39  D2315-5R0B  [esd0402]
D49  1N5819W  [SOD-123]
D66  D1250-5R5C  [esd0402]  (value not drawn)
D67  D1250-5R5C  [esd0402]  (value not drawn)
D68  D1250-5R5C  [esd0402]  (value not drawn)
D69  D1250-5R5C  [esd0402]  (value not drawn)
D70  D1250-5R5C  [esd0402]  (value not drawn)
D71  D1250-5R5C  [esd0402]  (value not drawn)
D72  D1250-5R5C  [esd0402]  (value not drawn)
D73  D1250-5R5C  [esd0402]  (value not drawn)
J17  HDMI-001C  [HDMI-SMD]
Q15  2SK3018  [SOT23]
Q16  2SK3018  [SOT23]
Q17  2SK3018  [SOT23]
Q18  2SK3018  [SOT23]
Q19  2SK3018  [SOT23]
Q20  2SK3018  [SOT23]
Q21  2SK3018  [SOT23]
Q22  2SK3018  [SOT23]
Q23  2SK3018  [SOT23]
R172  4.7K  [R0402]
R173  10K  [R0402]
R174  1K  [R0402]
R175  4.7K  [R0402]
R176  10K  [R0402]
R177  0R  [R0402]
R178  47K  [R0402]
R179  47K  [R0402]
R180  1.2K  [R0402]
R181  47K  [R0402]
R182  499R  [R0402]
R183  499R  [R0402]
R184  499R  [R0402]
R185  499R  [R0402]
R186  499R  [R0402]
R187  499R  [R0402]
R188  499R  [R0402]
R189  499R  [R0402]
R190  1K  [R0402]
R191  27K  [R0402]
R192  10K  [R0402]
R354  27K  [R0402]

### Nets
CORE_VCC_1V8_S0: Q15.1(GATE) Q23.1(GATE) R172.1 R174.1 R175.1 R191.1
GND: C153.2 D34.1 D35.1 D36.1 D37.1 D38.1 D39.1 D66.1 D67.1 D68.1 D69.1 D70.1 D71.1 D72.1 D73.1 J17.2 J17.5 J17.8 J17.11 J17.17 Q17.2(SOURCE) Q18.2(SOURCE) Q19.2(SOURCE) Q20.2(SOURCE) Q21.2(SOURCE) Q22.2(SOURCE) R177.2 R181.2 R192.2
HDMI1_5V: C153.1 D33.1 D39.2 J17.18 R173.1 R176.1
VCC_3V3_S0: D49.2 R178.1 R179.1
VCC_5V0_S0: D33.2
HDMI1_eARC+: C151.2 D37.2 J17.14
HDMI1_eARC-: C152.2 D34.2 J17.19 R180.2
HDMI1_TX_ON: R190.1 ; off-sheet HDMI1_TX_ON  [project net GPIO1_A7]
HDMI_TX1_CEC_M0: Q23.2(SOURCE) R191.2 ; off-sheet HDMI_TX1_CEC_M0
HDMI_TX1_CEC_PORT: D38.2 J17.13 Q23.3(DRAIN) R354.2
HDMI_TX1_D0N: C148.1 ; off-sheet HDMI_TX1_D0N
HDMI_TX1_D0N_PORT: C148.2 D68.2 J17.9 R188.1
HDMI_TX1_D0P: C147.1 ; off-sheet HDMI_TX1_D0P
HDMI_TX1_D0P_PORT: C147.2 D69.2 J17.7 R189.1
HDMI_TX1_D1N: C146.1 ; off-sheet HDMI_TX1_D1N
HDMI_TX1_D1N_PORT: C146.2 D70.2 J17.6 R186.1
HDMI_TX1_D1P: C145.1 ; off-sheet HDMI_TX1_D1P
HDMI_TX1_D1P_PORT: C145.2 D71.2 J17.4 R187.1
HDMI_TX1_D2N: C144.1 ; off-sheet HDMI_TX1_D2N
HDMI_TX1_D2N_PORT: C144.2 D72.2 J17.3 R184.1
HDMI_TX1_D2P: C143.1 ; off-sheet HDMI_TX1_D2P
HDMI_TX1_D2P_PORT: C143.2 D73.2 J17.1 R185.1
HDMI_TX1_D3N: C150.1 ; off-sheet HDMI_TX1_D3N
HDMI_TX1_D3N_PORT: C150.2 D66.2 J17.12 R182.1
HDMI_TX1_D3P: C149.1 ; off-sheet HDMI_TX1_D3P
HDMI_TX1_D3P_PORT: C149.2 D67.2 J17.10 R183.1
HDMI_TX1_HPD_M0: Q17.3(DRAIN) R178.2 ; off-sheet HDMI_TX1_HPD_M0
HDMI_TX1_SBDN: C152.1 ; off-sheet HDMI_TX1_SBDN
HDMI_TX1_SBDP: C151.1 ; off-sheet HDMI_TX1_SBDP
HDMI_TX1_SCL_M0: Q15.2(SOURCE) R172.2 ; off-sheet HDMI_TX1_SCL_M0
HDMI_TX1_SCL_PORT: D36.2 J17.15 Q15.3(DRAIN) R173.2
HDMI_TX1_SDA_M0: C154.2 Q16.2(SOURCE) R175.2 ; off-sheet HDMI_TX1_SDA_M0
HDMI_TX1_SDA_PORT: D35.2 J17.16 Q16.3(DRAIN) R176.2
NetC154_1: C154.1 Q16.1(GATE) R174.2
NetD49_1: D49.1 R354.1
NetJ17_G1: J17.G1 J17.G2 J17.G3 J17.G4 R177.1
NetQ17_1: Q17.1(GATE) Q18.3(DRAIN) R179.2
NetQ18_1: Q18.1(GATE) R180.1 R181.1
NetQ19_1: Q19.1(GATE) Q20.1(GATE) Q21.1(GATE) Q22.1(GATE) R190.2 R192.1
NetQ19_3: Q19.3(DRAIN) R182.2 R183.2
NetQ20_3: Q20.3(DRAIN) R184.2 R185.2
NetQ21_3: Q21.3(DRAIN) R186.2 R187.2
NetQ22_3: Q22.3(DRAIN) R188.2 R189.2

### Notes on the sheet
- HDMI2.1 TX1接口
- (near D73) D1250-5R5C*4
- GPIO1_A7
- (near D69) D1250-5R5C*4
- (in symbol HDMI-001C) TYPE A; D2P; G_D2; D2N; D1P; G_D1; D1N; D0P; G_D0; D0N; CLKP; G_CLK; CLKN; CEC; Utility; SCL; SDA; G_DDC; +5V; HPD; GND

### Library data of the parts
C143-C154 = CAP_NP
D33 D49 = DIODE_SCHTKY
D34-D39 D66-D73 = DIODE BI-DIR TRIG
R172-R192 R354 = RES